# EAGLE design canSlaveV02_8s (EAGLE 6.3)

## Sheet 1 of 6
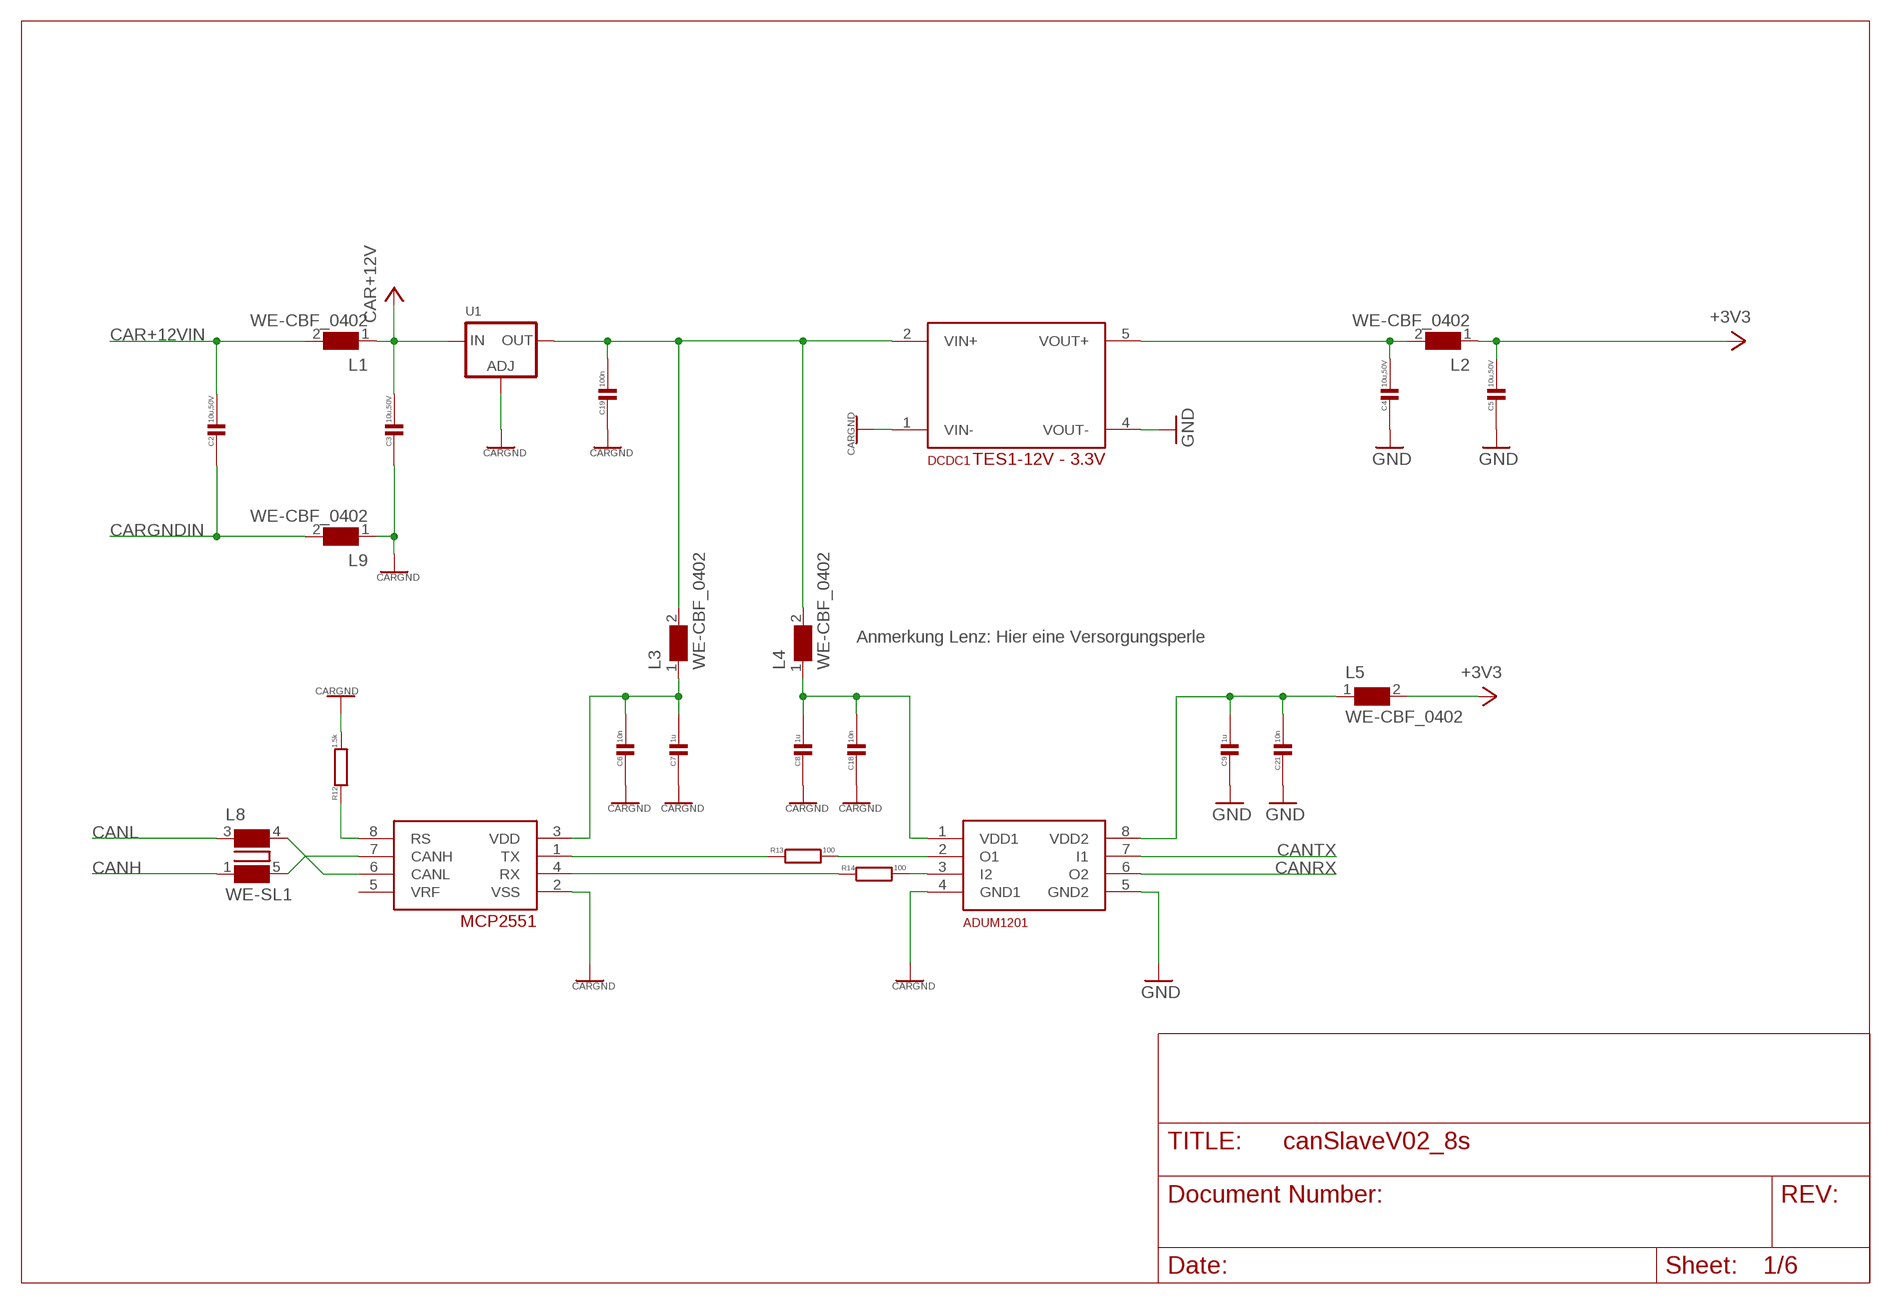
[diagram p0: schematic, sheet 1]

### Parts
C2  10u,50V  C0603  [C0603]
C3  10u,50V  C0603  [C0603]
C4  10u,50V  C0603  [C0603]
C5  10u,50V  C0603  [C0603]
C6  10n  C0402  [C0402]
C7  1u  C0402  [C0402]
C8  1u  C0402  [C0402]
C9  1u  C0402  [C0402]
C18  10n  C0402  [C0402]
C19  100n  C0402  [C0402]
C21  10n  C0402  [C0402]
DCDC1  TES1-12V - 3.3V  ISFXXXXA  [ISF]
IC3  ADUM1201  [SO-8]
IC4  MCP2551  [SO-8]
L1  WE-CBF_0402  [0402]
L2  WE-CBF_0402  [0402]
L3  WE-CBF_0402  [0402]
L4  WE-CBF_0402  [0402]
L5  WE-CBF_0402  [0402]
L8  WE-SL1  [WE-SL1]
L9  WE-CBF_0402  [0402]
R12  1.5k  R0402  [R0402]
R13  100  R0402  [R0402]
R14  100  R0402  [R0402]
U1  LM1117SOT223-REFLOW  [SOT223-R]

### Nets
+3V3: C5.1 L2.1 L5.2 ; also sheet 2,3
+3V3_AD: C9.1 C21.1 IC3.8(VDD2) L5.1
+3V3DCOUT: C4.1 DCDC1.5(VOUT+) L2.2
CANH: L8.1 ; also sheet 6
CANHL: IC4.7(CANH) L8.5
CANL: L8.3 ; also sheet 6
CANLL: IC4.6(CANL) L8.4
CANRX: IC3.6(O2) ; also sheet 2
CANTX: IC3.7(I1) ; also sheet 2
CAR+5V: C19.1 DCDC1.2(VIN+) L3.2 L4.2 U1.2(OUT) U1.4(OUT)
CAR+5V_AD: C8.1 C18.1 IC3.1(VDD1) L4.1
CAR+5V_CT: C6.1 C7.1 IC4.3(VDD) L3.1
CAR+12V: C3.1 L1.1 U1.3(IN)
CAR+12VIN: C2.1 L1.2 ; also sheet 6
CAR_CANRX: IC3.3(I2) R14.2
CAR_CANRX_T: IC4.4(RX) R14.1
CAR_CANTX: IC3.2(O1) R13.2
CAR_CANTX_T: IC4.1(TX) R13.1
CARGND: C3.2 C6.2 C7.2 C8.2 C18.2 C19.2 DCDC1.1(VIN-) IC3.4(GND1) IC4.2(VSS) L9.1 R12.2 U1.1(ADJ) ; also sheet 6
CARGNDIN: C2.2 L9.2 ; also sheet 6
GND: C4.2 C5.2 C9.2 C21.2 DCDC1.4(VOUT-) IC3.5(GND2) ; also sheet 2,3,5,6
RS: IC4.8(RS) R12.1
Unconnected: IC4.5(VRF)

### Notes on the sheet
- Anmerkung Lenz: Hier eine Versorgungsperle

## Sheet 2 of 6
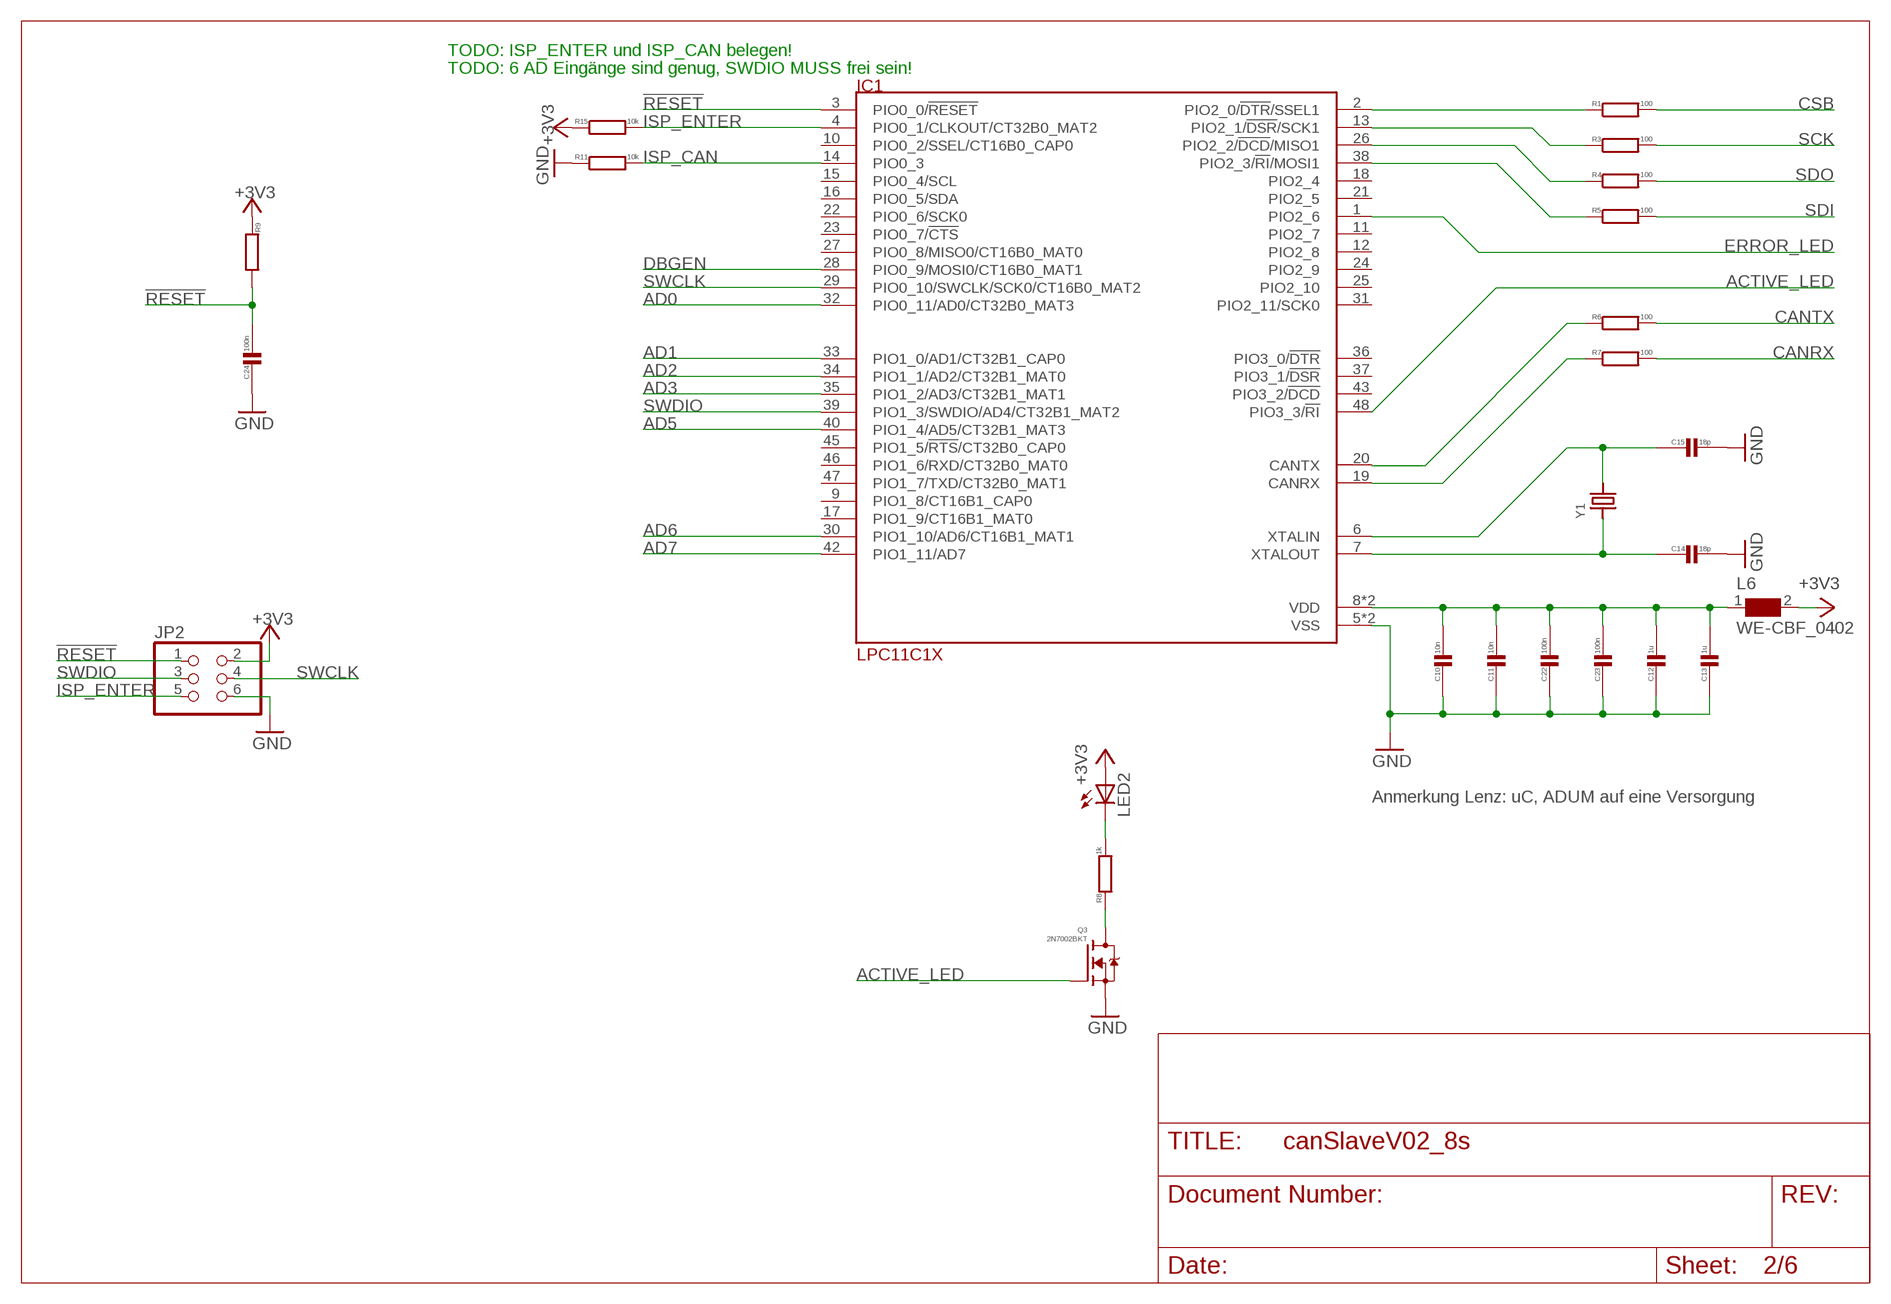
[diagram p1: schematic, sheet 2]

### Parts
C10  10n  C0402  [C0402]
C11  10n  C0402  [C0402]
C12  1u  C0402  [C0402]
C13  1u  C0402  [C0402]
C14  18p  C0402  [C0402]
C15  18p  C0402  [C0402]
C22  100n  C0402  [C0402]
C23  100n  C0402  [C0402]
C24  100n  C0402  [C0402]
IC1  LPC11C1X  [LQFP48]
JP2  HEADER-2X31.27  [2X03_1.27MM_SMT]
L6  WE-CBF_0402  [0402]
LED2  LEDCHIP-LED0603  [CHIP-LED0603]
Q3  2N7002BKT  [SOT416]
R1  100  R0402  [R0402]
R3  100  R0402  [R0402]
R4  100  R0402  [R0402]
R5  100  R0402  [R0402]
R6  100  R0402  [R0402]
R7  100  R0402  [R0402]
R8  1k  R0402  [R0402]
R9  R0402  [R0402]
R11  10k  R0402  [R0402]
R15  10k  R0402  [R0402]
Y1  CRYSTALTHIN  [CRYSTAL_3.2X2.5]

### Nets
!RESET: C24.1 IC1.3(PIO0_0/!RESET) JP2.1 R9.2
+3V3: JP2.2 L6.2 LED2.A R9.1 R15.1 ; also sheet 1,3
+3V3_UC: C10.1 C11.1 C12.1 C13.1 C22.1 C23.1 IC1.8(VDD) IC1.44(VDD) L6.1 ; also sheet 5
ACTIVE_LED: IC1.48(PIO3_3/!RI) Q3.1(G)
AD0: IC1.32(PIO0_11/AD0/CT32B0_MAT3)
AD1: IC1.33(PIO1_0/AD1/CT32B1_CAP0) ; also sheet 5,6
AD2: IC1.34(PIO1_1/AD2/CT32B1_MAT0) ; also sheet 5,6
AD3: IC1.35(PIO1_2/AD3/CT32B1_MAT1)
AD5: IC1.40(PIO1_4/AD5/CT32B1_MAT3)
AD6: IC1.30(PIO1_10/AD6/CT16B1_MAT1)
AD7: IC1.42(PIO1_11/AD7)
CANRX: R7.2 ; also sheet 1
CANRX_U: IC1.19(CANRX) R7.1
CANTX: R6.2 ; also sheet 1
CANTX_U: IC1.20(CANTX) R6.1
CSB: R1.2 ; also sheet 3
DBGEN: IC1.28(PIO0_9/MOSI0/CT16B0_MAT1)
ERROR_LED: IC1.1(PIO2_6)
GND: C10.2 C11.2 C12.2 C13.2 C14.1 C15.1 C22.2 C23.2 C24.2 IC1.5(VSS) IC1.41(VSS) JP2.6 Q3.2(S) R11.1 ; also sheet 1,3,5,6
ISP_CAN: IC1.14(PIO0_3) R11.2
ISP_ENTER: IC1.4(PIO0_1/CLKOUT/CT32B0_MAT2) JP2.5 R15.2
LED1C1: LED2.C R8.2
MISO1: IC1.26(PIO2_2/!DCD!/MISO1) R4.1
MOSI1: IC1.38(PIO2_3/!RI!/MOSI1) R5.1
Q3_COL: Q3.3(D) R8.1
SCK: R3.2 ; also sheet 3
SCK1: IC1.13(PIO2_1/!DSR!/SCK1) R3.1
SDI: R5.2 ; also sheet 3
SDO: R4.2 ; also sheet 3
SSEL: IC1.2(PIO2_0/!DTR!/SSEL1) R1.1
SWCLK: IC1.29(PIO0_10/SWCLK/SCK0/CT16B0_MAT2) JP2.4
SWDIO: IC1.39(PIO1_3/SWDIO/AD4/CT32B1_MAT2) JP2.3
XTALIN: C15.2 IC1.6(XTALIN) Y1.2
XTALOUT: C14.2 IC1.7(XTALOUT) Y1.1
Unconnected: IC1.9(PIO1_8/CT16B1_CAP0) IC1.10(PIO0_2/SSEL/CT16B0_CAP0) IC1.11(PIO2_7) IC1.12(PIO2_8) IC1.15(PIO0_4/SCL) IC1.16(PIO0_5/SDA) IC1.17(PIO1_9/CT16B1_MAT0) IC1.18(PIO2_4) IC1.21(PIO2_5) IC1.22(PIO0_6/SCK0) IC1.23(PIO0_7/!CTS) IC1.24(PIO2_9) IC1.25(PIO2_10) IC1.27(PIO0_8/MISO0/CT16B0_MAT0) IC1.31(PIO2_11/SCK0) IC1.36(PIO3_0/!DTR) IC1.37(PIO3_1/!DSR) IC1.43(PIO3_2/!DCD) IC1.45(PIO1_5/!RTS!/CT32B0_CAP0) IC1.46(PIO1_6/RXD/CT32B0_MAT0) IC1.47(PIO1_7/TXD/CT32B0_MAT1)

### Notes on the sheet
- TODO: ISP_ENTER und ISP_CAN belegen!
- TODO: 6 AD Eingänge sind genug, SWDIO MUSS frei sein!
- Anmerkung Lenz: uC, ADUM auf eine Versorgung

## Sheet 3 of 6
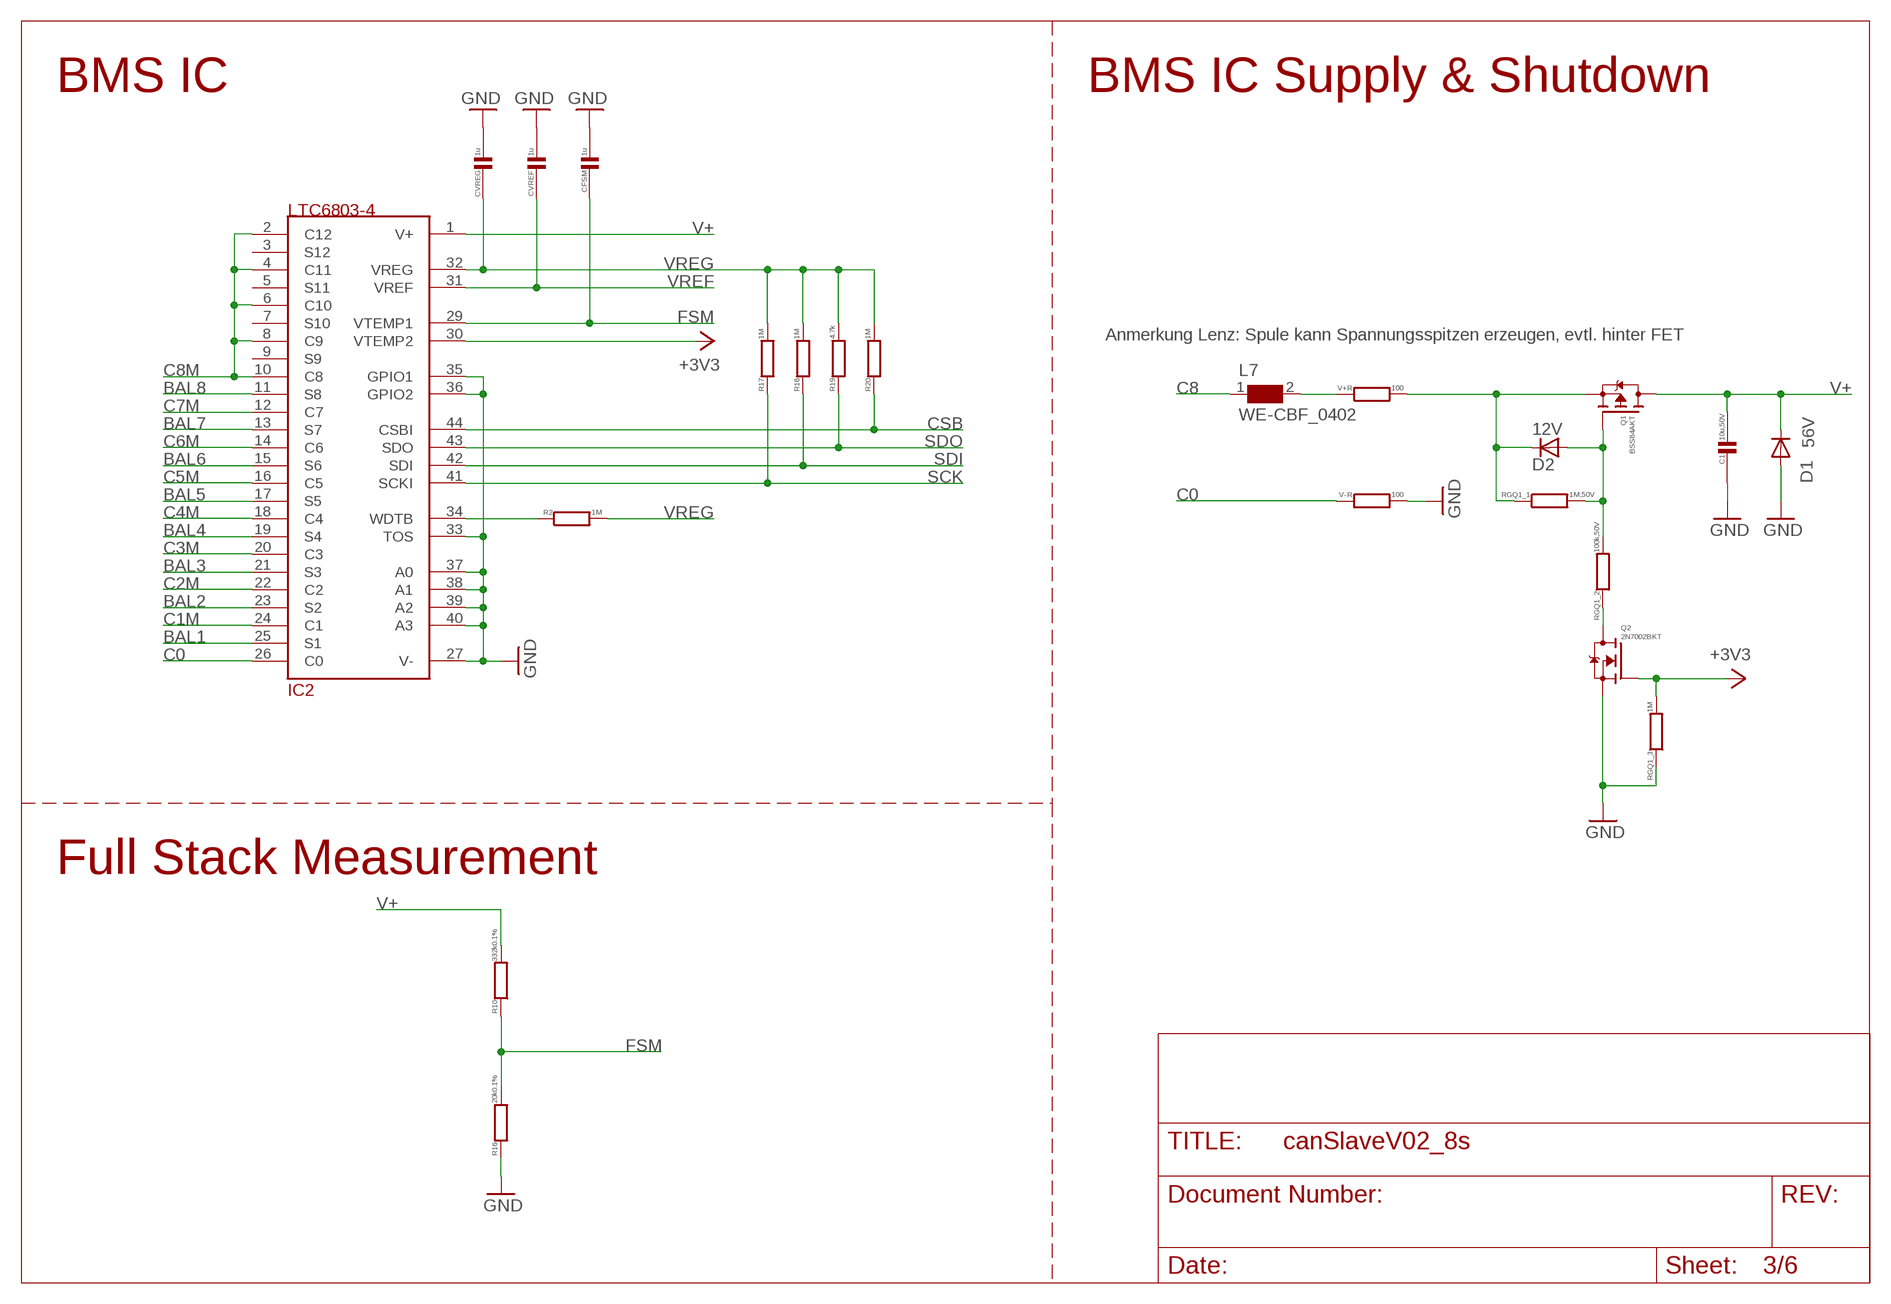
[diagram p2: schematic, sheet 3]

### Parts
C1  10u,50V  C1206  [C1206]
CFSM  1u  C0402  [C0402]
CVREF  1u  C0402  [C0402]
CVREG  1u  C0402  [C0402]
D1  56V  DIODE-SOD323-R  [SOD323-R]
D2  12V  DIODE-SOD323-R  [SOD323-R]
IC2  LTC6803-4  [44SSOP]
L7  WE-CBF_0402  [0402]
Q1  BSS84AKT  [SOT416]
Q2  2N7002BKT  [SOT416]
R2  1M  R0402  [R0402]
R10  332k0.1%  R0603  [R0603]
R16  20k0.1%  R0603  [R0603]
R17  1M  R0402  [R0402]
R18  1M  R0402  [R0402]
R19  4.7k  R0402  [R0402]
R20  1M  R0402  [R0402]
RGQ1_1  1M,50V  R0603  [R0603]
RGQ1_2  100k,50V  R0603  [R0603]
RGQ1_3  1M  R0402  [R0402]
V+R  100  R0402  [R0402]
V-R  100  R0402  [R0402]

### Nets
+3V3: IC2.30(VTEMP2) Q2.1(G) RGQ1_3.2 ; also sheet 1,2
BAL1: IC2.25(S1) ; also sheet 4
BAL2: IC2.23(S2) ; also sheet 4
BAL3: IC2.21(S3) ; also sheet 4
BAL4: IC2.19(S4) ; also sheet 4
BAL5: IC2.17(S5) ; also sheet 4
BAL6: IC2.15(S6) ; also sheet 4
BAL7: IC2.13(S7) ; also sheet 4
BAL8: IC2.11(S8) ; also sheet 4
C0: IC2.26(C0) V-R.1 ; also sheet 4,6
C1M: IC2.24(C1) ; also sheet 4
C2M: IC2.22(C2) ; also sheet 4
C3M: IC2.20(C3) ; also sheet 4
C4M: IC2.18(C4) ; also sheet 4
C5M: IC2.16(C5) ; also sheet 4
C6M: IC2.14(C6) ; also sheet 4
C7M: IC2.12(C7) ; also sheet 4
C8: L7.1 ; also sheet 4,6
C8F: L7.2 V+R.1
C8M: IC2.2(C12) IC2.4(C11) IC2.6(C10) IC2.8(C9) IC2.10(C8) ; also sheet 4
CSB: IC2.44(CSBI) R20.1 ; also sheet 2
FSM: CFSM.2 IC2.29(VTEMP1) R10.1 R16.2
GND: C1.2 CFSM.1 CVREF.1 CVREG.1 D1.A IC2.27(V-) IC2.33(TOS) IC2.35(GPIO1) IC2.36(GPIO2) IC2.37(A0) IC2.38(A1) IC2.39(A2) IC2.40(A3) Q2.2(S) R16.1 RGQ1_3.1 V-R.2 ; also sheet 1,2,5,6
Q1G: D2.A Q1.1(G) RGQ1_1.2 RGQ1_2.2
Q2D: Q2.3(D) RGQ1_2.1
SCK: IC2.41(SCKI) R17.1 ; also sheet 2
SDI: IC2.42(SDI) R18.1 ; also sheet 2
SDO: IC2.43(SDO) R19.1 ; also sheet 2
V+: C1.1 D1.C IC2.1(V+) Q1.3(D) R10.2
V+S: D2.C Q1.2(S) RGQ1_1.1 V+R.2
VREF: CVREF.2 IC2.31(VREF)
VREG: CVREG.2 IC2.32(VREG) R2.2 R17.2 R18.2 R19.2 R20.2
WDTB: IC2.34(WDTB) R2.1
Unconnected: IC2.3(S12) IC2.5(S11) IC2.7(S10) IC2.9(S9)

### Notes on the sheet
- BMS IC | BMS IC Supply & Shutdown
- Anmerkung Lenz: Spule kann Spannungsspitzen erzeugen, evtl. hinter FET
- Full Stack Measurement

## Sheet 4 of 6
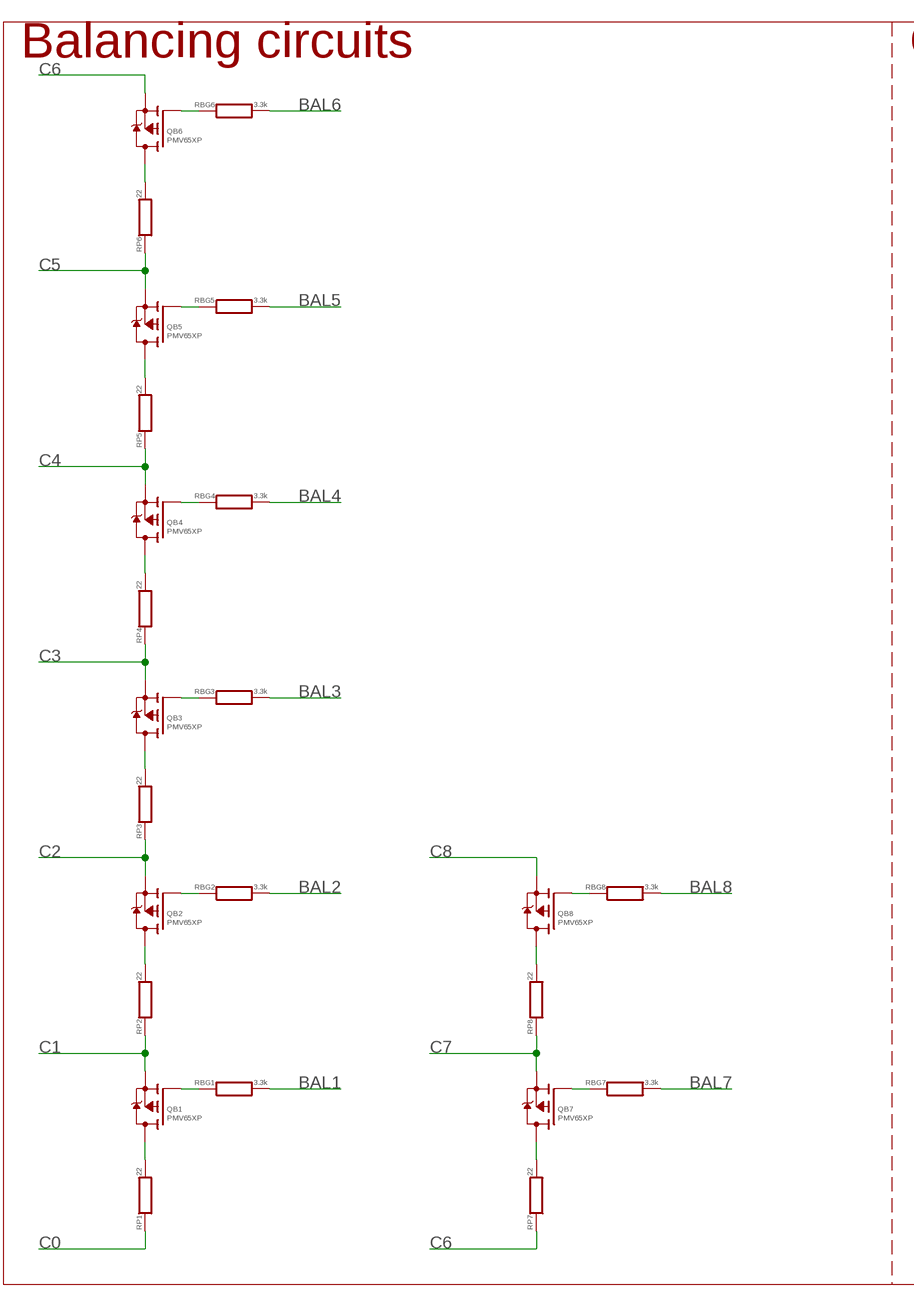
[diagram p3: schematic, sheet 4, part 1 of 2]
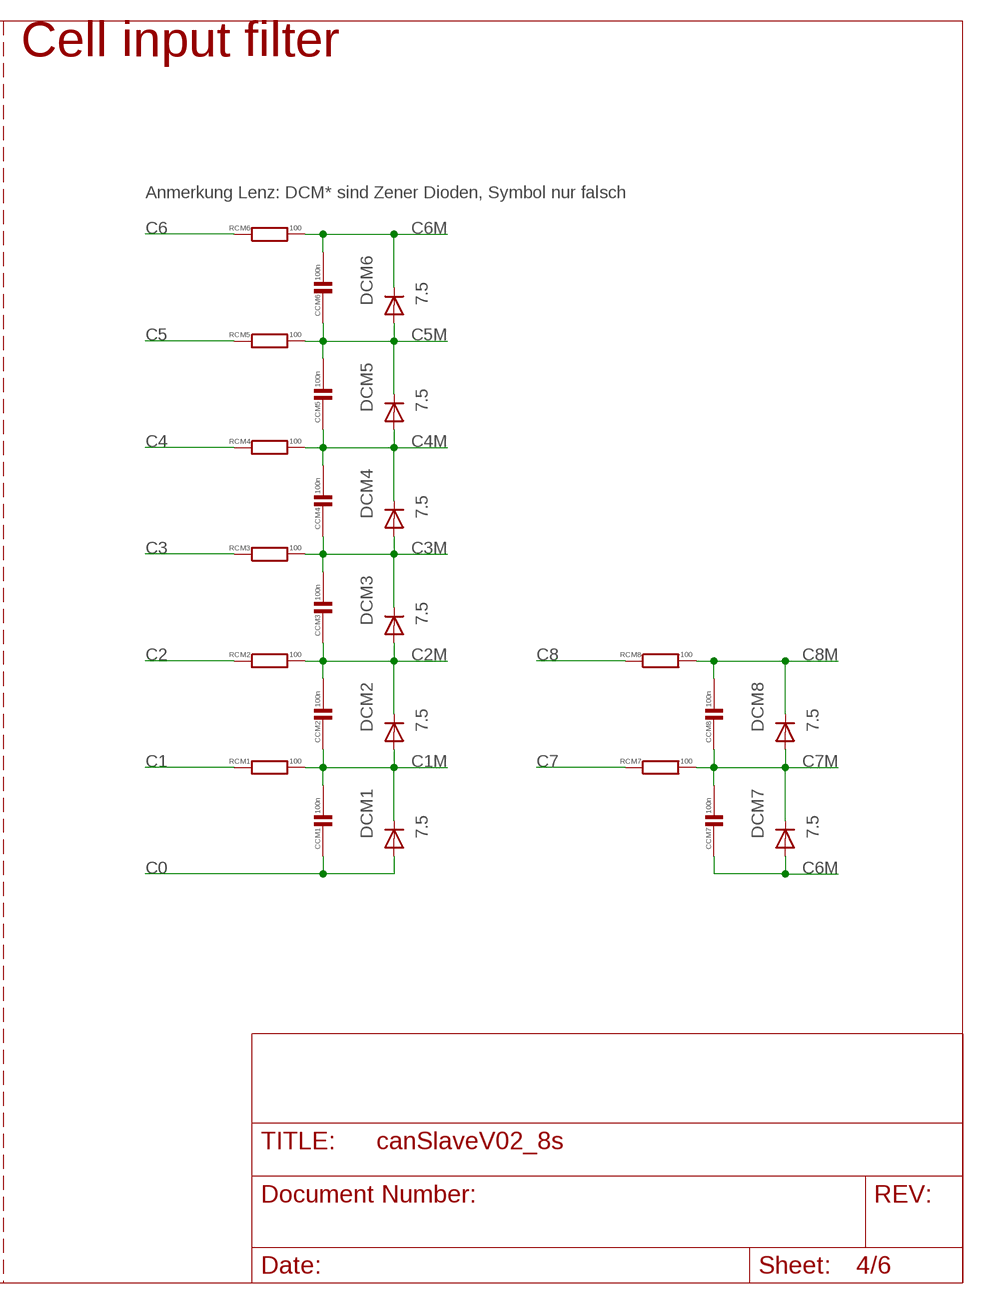
[diagram p4: schematic, sheet 4, part 2 of 2]

### Parts
CCM1  100n  C0402  [C0402]
CCM2  100n  C0402  [C0402]
CCM3  100n  C0402  [C0402]
CCM4  100n  C0402  [C0402]
CCM5  100n  C0402  [C0402]
CCM6  100n  C0402  [C0402]
CCM7  100n  C0402  [C0402]
CCM8  100n  C0402  [C0402]
DCM1  7.5  DIODE-SOD323-R  [SOD323-R]
DCM2  7.5  DIODE-SOD323-R  [SOD323-R]
DCM3  7.5  DIODE-SOD323-R  [SOD323-R]
DCM4  7.5  DIODE-SOD323-R  [SOD323-R]
DCM5  7.5  DIODE-SOD323-R  [SOD323-R]
DCM6  7.5  DIODE-SOD323-R  [SOD323-R]
DCM7  7.5  DIODE-SOD323-R  [SOD323-R]
DCM8  7.5  DIODE-SOD323-R  [SOD323-R]
QB1  PMV65XP  BSS84AKT  [SOT416]
QB2  PMV65XP  BSS84AKT  [SOT416]
QB3  PMV65XP  BSS84AKT  [SOT416]
QB4  PMV65XP  BSS84AKT  [SOT416]
QB5  PMV65XP  BSS84AKT  [SOT416]
QB6  PMV65XP  BSS84AKT  [SOT416]
QB7  PMV65XP  BSS84AKT  [SOT416]
QB8  PMV65XP  BSS84AKT  [SOT416]
RBG1  3.3k  R0402  [R0402]
RBG2  3.3k  R0402  [R0402]
RBG3  3.3k  R0402  [R0402]
RBG4  3.3k  R0402  [R0402]
RBG5  3.3k  R0402  [R0402]
RBG6  3.3k  R0402  [R0402]
RBG7  3.3k  R0402  [R0402]
RBG8  3.3k  R0402  [R0402]
RCM1  100  R0402  [R0402]
RCM2  100  R0402  [R0402]
RCM3  100  R0402  [R0402]
RCM4  100  R0402  [R0402]
RCM5  100  R0402  [R0402]
RCM6  100  R0402  [R0402]
RCM7  100  R0402  [R0402]
RCM8  100  R0402  [R0402]
RP1  22  R2512  [R2512]
RP2  22  R2512  [R2512]
RP3  22  R2512  [R2512]
RP4  22  R2512  [R2512]
RP5  22  R2512  [R2512]
RP6  22  R2512  [R2512]
RP7  22  R2512  [R2512]
RP8  22  R2512  [R2512]

### Nets
BAL1: RBG1.2 ; also sheet 3
BAL2: RBG2.2 ; also sheet 3
BAL3: RBG3.2 ; also sheet 3
BAL4: RBG4.2 ; also sheet 3
BAL5: RBG5.2 ; also sheet 3
BAL6: RBG6.2 ; also sheet 3
BAL7: RBG7.2 ; also sheet 3
BAL8: RBG8.2 ; also sheet 3
C0: CCM1.2 DCM1.A RP1.1 ; also sheet 3,6
C1: QB1.2(S) RCM1.1 RP2.1 ; also sheet 6
C1M: CCM1.1 CCM2.2 DCM1.C DCM2.A RCM1.2 ; also sheet 3
C2: QB2.2(S) RCM2.1 RP3.1 ; also sheet 6
C2M: CCM2.1 CCM3.2 DCM2.C DCM3.A RCM2.2 ; also sheet 3
C3: QB3.2(S) RCM3.1 RP4.1 ; also sheet 6
C3M: CCM3.1 CCM4.2 DCM3.C DCM4.A RCM3.2 ; also sheet 3
C4: QB4.2(S) RCM4.1 RP5.1 ; also sheet 6
C4M: CCM4.1 CCM5.2 DCM4.C DCM5.A RCM4.2 ; also sheet 3
C5: QB5.2(S) RCM5.1 RP6.1 ; also sheet 6
C5M: CCM5.1 CCM6.2 DCM5.C DCM6.A RCM5.2 ; also sheet 3
C6: QB6.2(S) RCM6.1 RP7.1 ; also sheet 6
C6M: CCM6.1 CCM7.2 DCM6.C DCM7.A RCM6.2 ; also sheet 3
C7: QB7.2(S) RCM7.1 RP8.1 ; also sheet 6
C7M: CCM7.1 CCM8.2 DCM7.C DCM8.A RCM7.2 ; also sheet 3
C8: QB8.2(S) RCM8.1 ; also sheet 3,6
C8M: CCM8.1 DCM8.C RCM8.2 ; also sheet 3
CR1: QB1.3(D) RP1.2
CR2: QB2.3(D) RP2.2
CR3: QB3.3(D) RP3.2
CR4: QB4.3(D) RP4.2
CR5: QB5.3(D) RP5.2
CR6: QB6.3(D) RP6.2
CR7: QB7.3(D) RP7.2
CR8: QB8.3(D) RP8.2
QBG1: QB1.1(G) RBG1.1
QBG2: QB2.1(G) RBG2.1
QBG3: QB3.1(G) RBG3.1
QBG4: QB4.1(G) RBG4.1
QBG5: QB5.1(G) RBG5.1
QBG6: QB6.1(G) RBG6.1
QBG7: QB7.1(G) RBG7.1
QBG8: QB8.1(G) RBG8.1

### Notes on the sheet
- Balancing circuits | Cell input filter
- Anmerkung Lenz: DCM* sind Zener Dioden, Symbol nur falsch

## Sheet 5 of 6
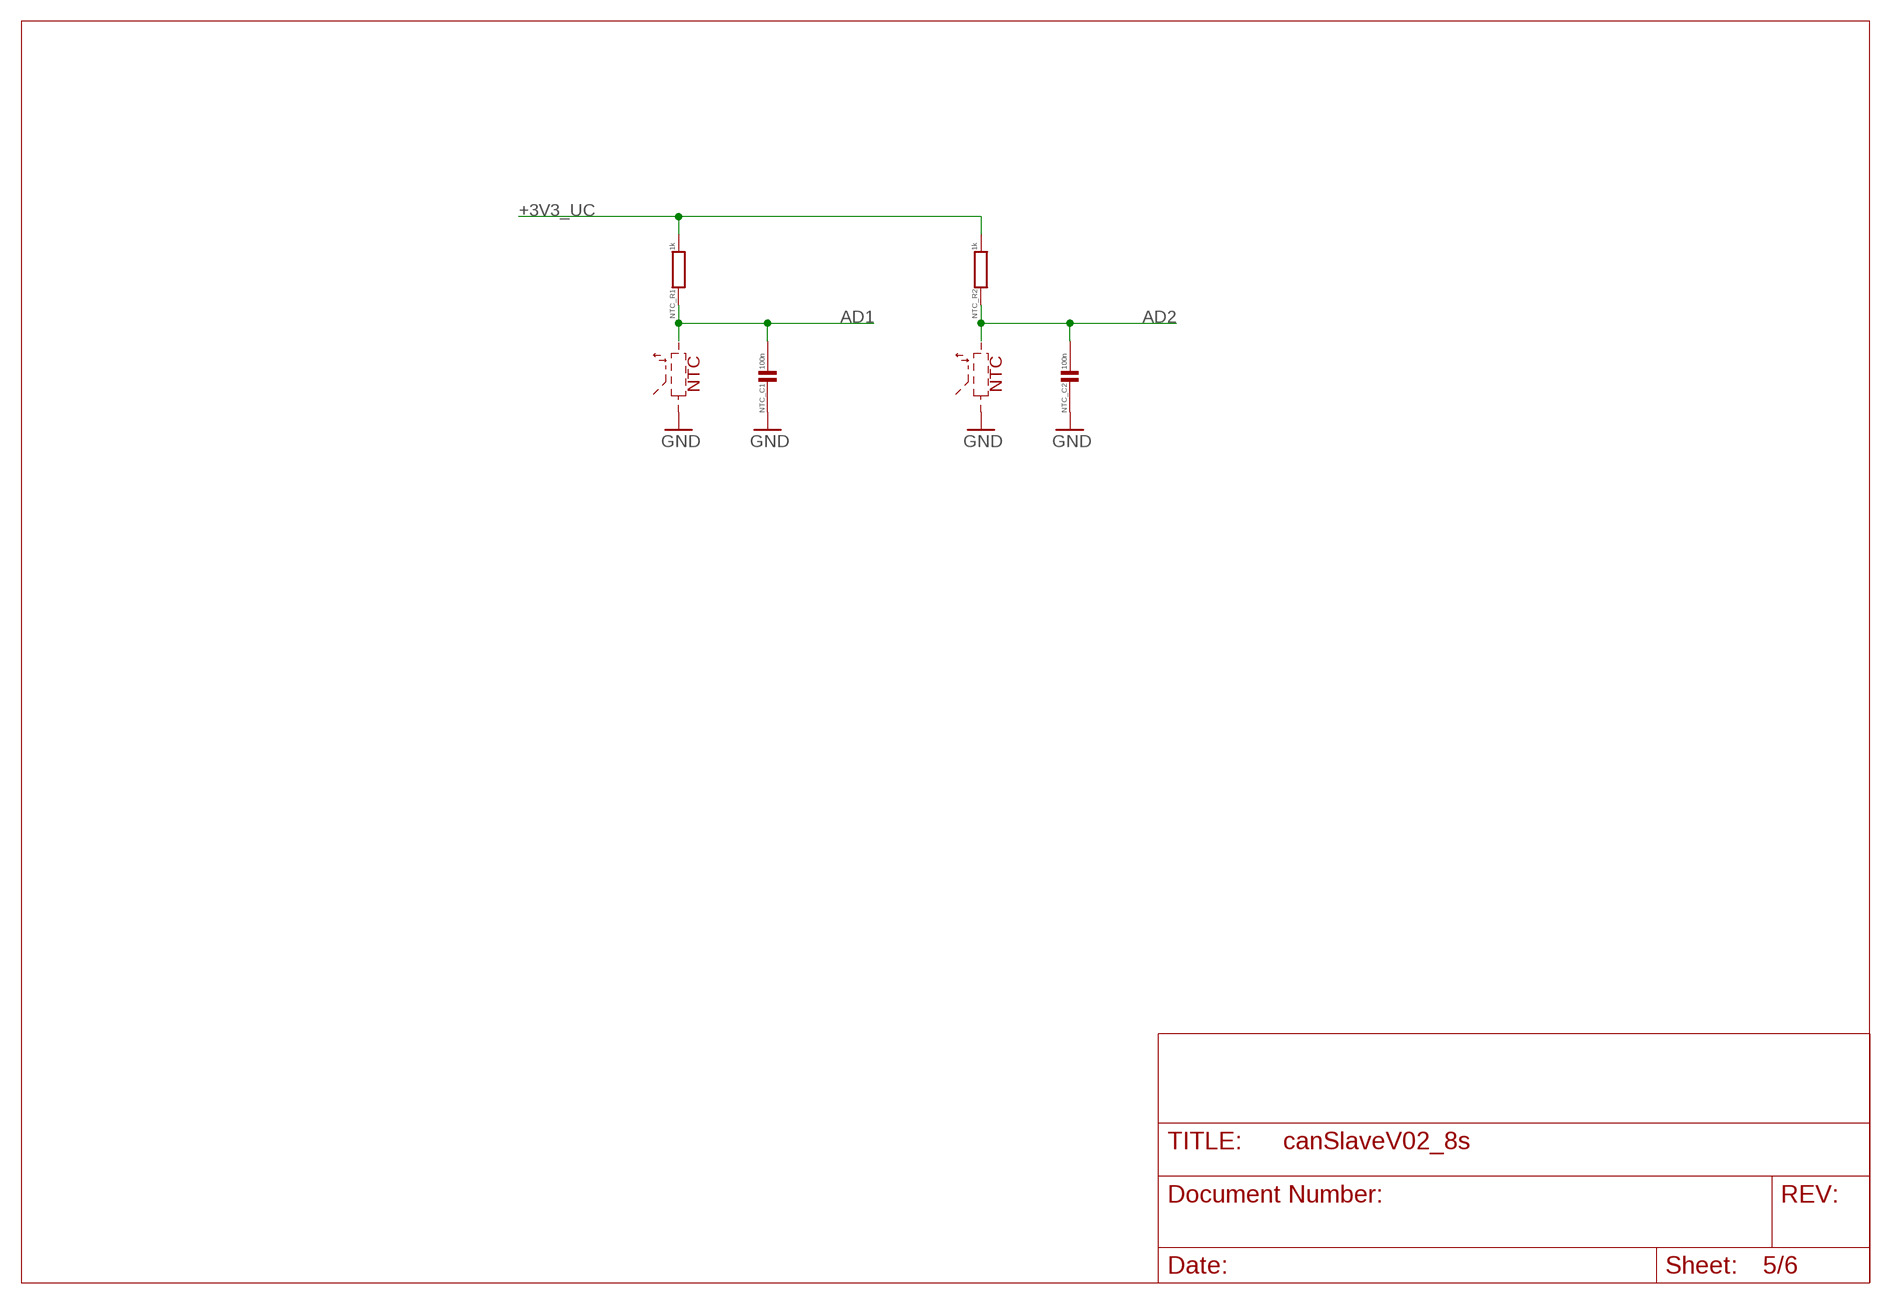
[diagram p5: schematic, sheet 5]

### Parts
NTC_C1  100n  C0402  [C0402]
NTC_C2  100n  C0402  [C0402]
NTC_R1  1k  R0402  [R0402]
NTC_R2  1k  R0402  [R0402]

### Nets
+3V3_UC: NTC_R1.2 NTC_R2.2 ; also sheet 2
AD1: NTC_C1.1 NTC_R1.1 ; also sheet 2,6
AD2: NTC_C2.1 NTC_R2.1 ; also sheet 2,6
GND: NTC_C1.2 NTC_C2.2 ; also sheet 1,2,3,6

### Notes on the sheet
- NTC | NTC

## Sheet 6 of 6
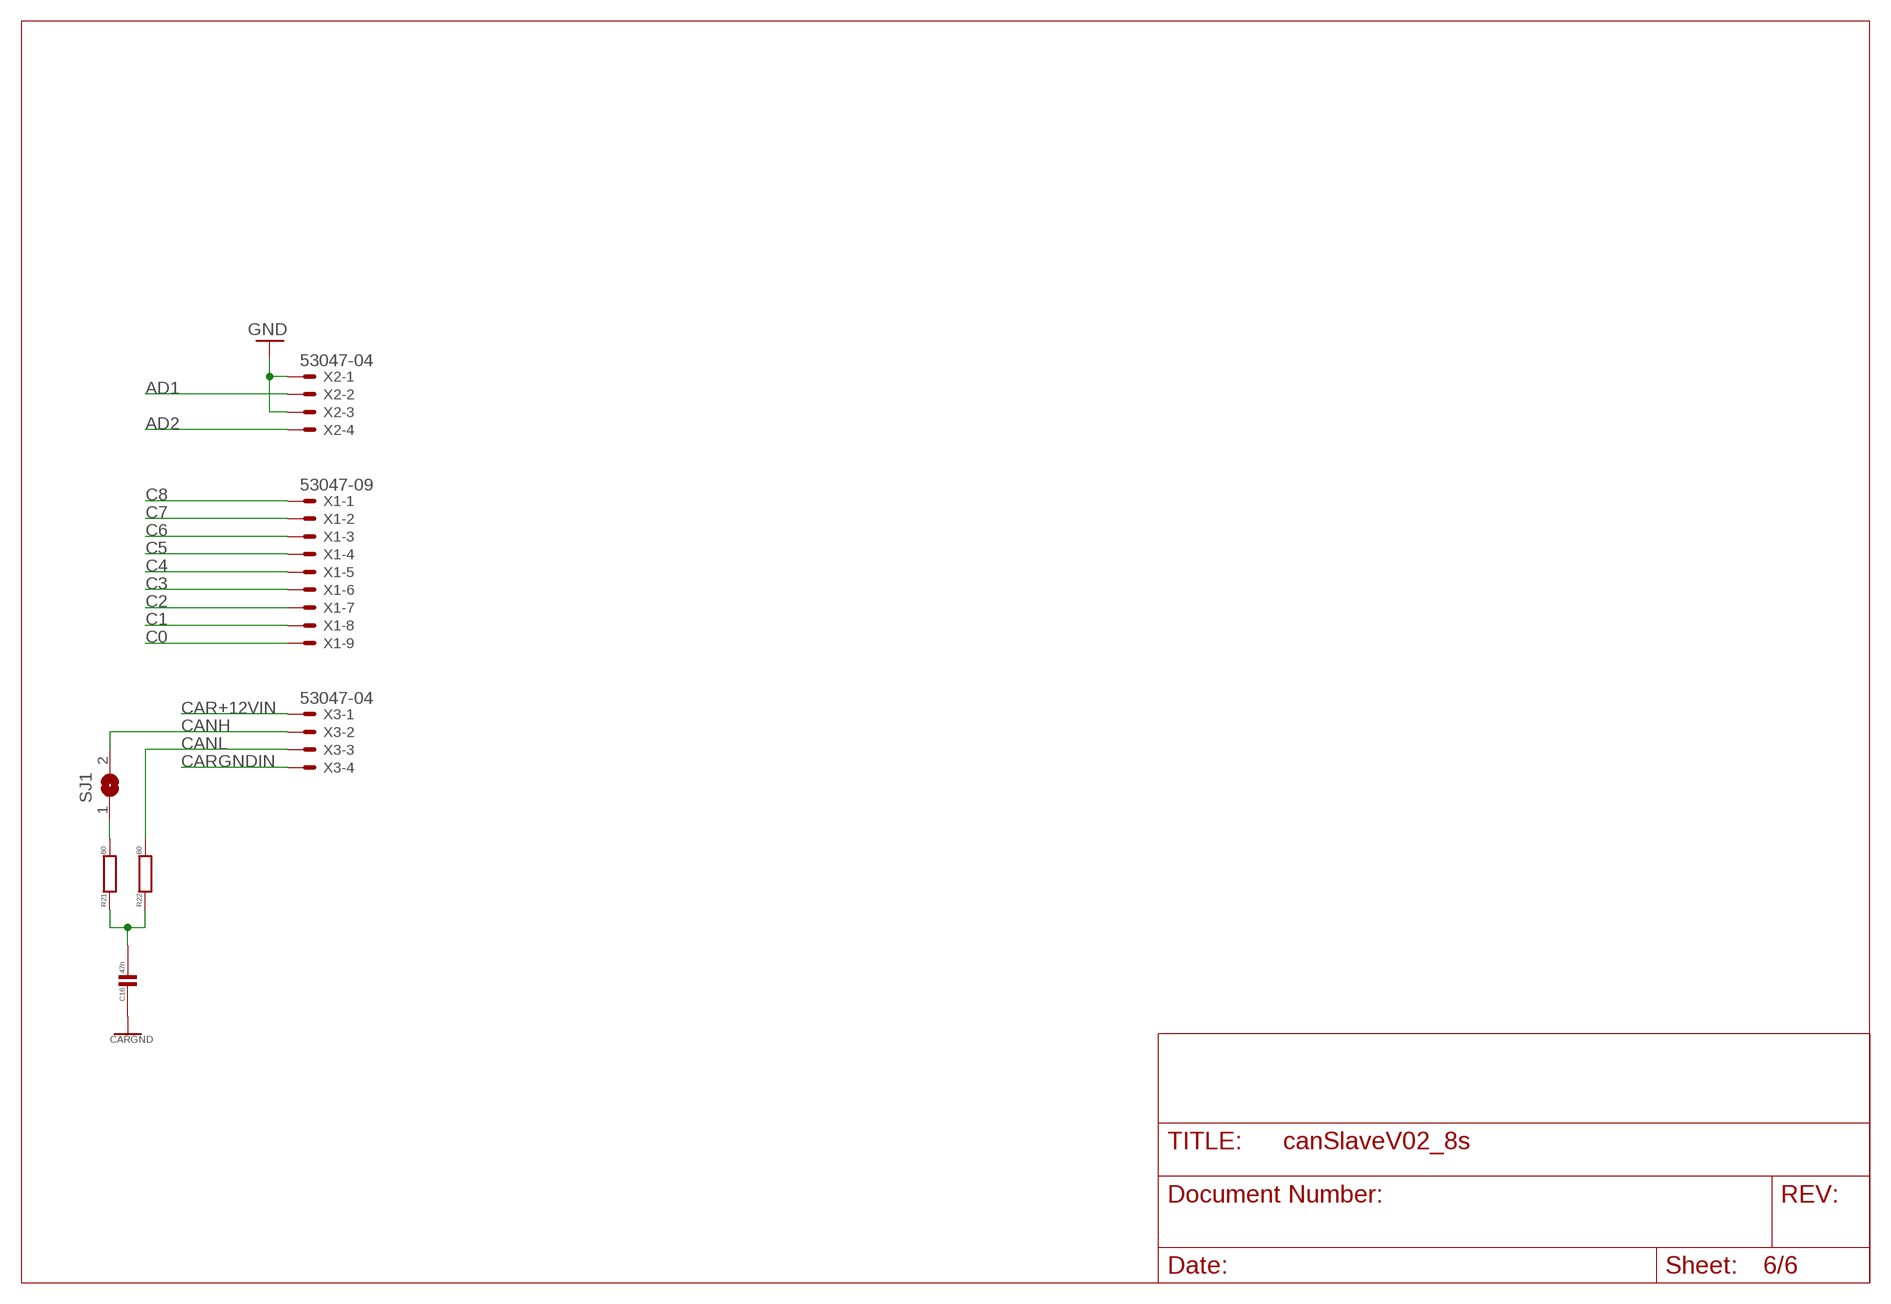
[diagram p6: schematic, sheet 6]

### Parts
C16  47n  C0402  [C0402]
R21  60  R0402  [R0402]
R22  60  R0402  [R0402]
SJ1  SOLDERJUMPERSMALL  [SOLDERJUMPER_REFLOW_NOPASTE_SMALL]
X1  53047-09  [53047-09]
X2  53047-04  [53047-04]
X3  53047-04  [53047-04]

### Nets
AD1: X2.2 ; also sheet 2,5
AD2: X2.4 ; also sheet 2,5
C0: X1.9 ; also sheet 3,4
C1: X1.8 ; also sheet 4
C2: X1.7 ; also sheet 4
C3: X1.6 ; also sheet 4
C4: X1.5 ; also sheet 4
C5: X1.4 ; also sheet 4
C6: X1.3 ; also sheet 4
C7: X1.2 ; also sheet 4
C8: X1.1 ; also sheet 3,4
CANH: SJ1.2 X3.2 ; also sheet 1
CANJ: R21.2 SJ1.1
CANL: R22.2 X3.3 ; also sheet 1
CANT: C16.1 R21.1 R22.1
CAR+12VIN: X3.1 ; also sheet 1
CARGND: C16.2 ; also sheet 1
CARGNDIN: X3.4 ; also sheet 1
GND: X2.1 X2.3 ; also sheet 1,2,3,5

## Library data of the parts
C1-C16 C18 C19 C21-C24 CCM1-CCM8 CFSM CVREF CVREG NTC_C1 NTC_C2 = phrenetic:C
D1 D2 DCM1-DCM8 = diode:DIODE-: DIODE
DCDC1 = bms-hsrm:ISFXXXXA
IC1 = phrenetic:LPC11C1X
IC2 = bms-hsrm:LTC6803-4
IC3 = bms-hsrm:ADUM1201
IC4 = bms-hsrm:MCP2551
JP2 = microbuilder:HEADER-2X3: PIN HEADER
L1-L7 L9 = EagleLibrary_Wuerth_Elektronik_eiSos_Version_6:WE-CBF: SMD EMI Suppression Ferrite Beads WE-CBF - Excellent anti-EMI properties - Low DC-restistance - Impedances till 3000 ohms - Rated current up to 6 A -- Reliable Ni-Sn electrodes -- Perfect as data lined filter and for uncoupling of distribution voltage
L8 = EagleLibrary_Wuerth_Elektronik_eiSos_Version_6:WE-SL1: SMD Common Mode Line Filter WE-SL1 - Small size - Low Profile, only 1,65 mm - High Impedance up to 2000 ohm - High Current up to 300mA - Low leakage inductance -- USB -- CAN -- Firewire -- Data Lines -- Power Lines
LED2 = led:LED: LED OSRAM: - CHIPLED LG R971, LG N971, LY N971, LG Q971, LY Q971, LO R971, LY R971 LH N974, LH R974 LS Q976, LO Q976, LY Q976 LO Q996 - Hyper CHIPLED LW Q18S LB Q993, LB Q99A, LB R99A - SideLED LS A670, LO A670, LY A670, LG A670, LP A670 LB A673, LV A673, LT A673, LW A673 LH A674 LY A675 LS A676, LA A676, LO A676, LY A676, LW A676 LS A679, LY A679, LG A679 - Hyper Micro SIDELED® LS Y876, LA Y876, LO Y876, LY Y876 LT Y87S - SmartLED LW L88C, LW L88S LB L89C, LB L89S, LG L890 LS L89K, LO L89K, LY L89K LS L896, LA L896, LO L896, LY L896 - TOPLED LS T670, LO T670, LY T670, LG T670, LP T670 LSG T670, LSP T670, LSY T670, LOP T670, LYG T670 LG T671, LOG T671, LSG T671 LB T673, LV T673, LT T673, LW T673 LH T674 LS T676, LA T676, LO T676, LY T676, LB T676, LH T676, LSB T676, LW T676 LB T67C, LV T67C, LT T67C, LS T67K, LO T67K, LY T67K, LW E67C LS E67B, LA E67B, LO E67B, LY E67B, LB E67C, LV E67C, LT E67C LW T67C LS T679, LY T679, LG T679 LS T770, LO T770, LY T770, LG T770, LP T770 LB T773, LV T773, LT T773, LW T773 LH T774 LS E675, LA E675, LY E675, LS T675 LS T776, LA T776, LO T776, LY T776, LB T776 LHGB T686 LT T68C, LB T68C - Hyper Mini TOPLED® LB M676 - Mini TOPLED Santana® LG M470 LS M47K, LO M47K, LY M47K Source: http://www.osram.convergy.de LUXEON: - LUMILED® LXK2-PW12-R00, LXK2-PW12-S00, LXK2-PW14-U00, LXK2-PW14-V00 LXK2-PM12-R00, LXK2-PM12-S00, LXK2-PM14-U00 LXK2-PE12-Q00, LXK2-PE12-R00, LXK2-PE12-S00, LXK2-PE14-T00, LXK2-PE14-U00 LXK2-PB12-K00, LXK2-PB12-L00, LXK2-PB12-M00, LXK2-PB14-N00, LXK2-PB14-P00, LXK2-PB14-Q00 LXK2-PR12-L00, LXK2-PR12-M00, LXK2-PR14-Q00, LXK2-PR14-R00 LXK2-PD12-Q00, LXK2-PD12-R00, LXK2-PD12-S00 LXK2-PH12-R00, LXK2-PH12-S00 LXK2-PL12-P00, LXK2-PL12-Q00, LXK2-PL12-R00 Source: www.luxeon.com KINGBRIGHT: KA-3528ASYC Source: www.kingbright.com
NTC_R1 NTC_R2 R1-R22 RBG1-RBG8 RCM1-RCM8 RGQ1_1-RGQ1_3 RP1-RP8 V+R V-R = phrenetic:R: RESISTOR, Bla
Q1 QB1-QB8 = phrenetic:BSS84
Q2 Q3 = phrenetic:2N7002
SJ1 = microbuilder:SOLDERJUMPER: SMD Solder JUMPER Solder the two pads together to create a connection, or remove the solder to break it. REFLOW - Use this footprint for solder paste and reflow ovens. WAVE - Use this footprint for hand-soldering (larger pads). CLOSED - Has a trace between the two pads to ensure it is closed by default. The trace needs to be cut to disable the jumper, and can be closed again by creating a solder bridge between the two pads.
U1 = microbuilder:LM1117: LM1117 Voltage Regulator LM1117 Adjustable Voltage regulator [Digikey: LM1117IMP-ADJDKR-ND] LM1117 3.3V Voltage regulator [AP1117E33GDIDKR-ND] LM1117 5.0V Voltage regulator [AP1117E50GDIDKR-ND] SOT223-REFLOW - SOT223 package for solder paste/reflow ovens SOT223-WAVE - SOT223 package for hand-soldering (larger pads) Note: For the fixed-voltage regulators, simply set the ADJ pin to GND.
X1 = con-molex:53?-09: CONNECTOR wire to board 1.25 mm (.049 inch) pitch header; MPN: 53047-0910; OC_FARNELL: 9732888; OC_NEWARK: 98K9827
X2 X3 = con-molex:53?-04: CONNECTOR wire to board 1.25 mm (.049 inch) pitch header; MF: WALDOM/MOLEX; MPN: 53047-0410; OC_FARNELL: 9733060; OC_NEWARK: 38C9900
Y1 = microbuilder:CRYSTAL: Crystals HC49UP - Surface Mount Crystal 4.0MHz 18pF +/-30ppm Surface Mount Crystal [Digikey: 535-9857-1-ND] 12.0 MHz Surface Mount Crystal [Digikey: 535-9869-6-ND] 25.0 MHz Surface Mount Crystal [Digikey: 535-9078-1-ND] 2.5 x 2.0mm - MEMs SMT Crystal 16.0 MHz 10pF 20ppm 2.5 x 2.0mm Crystal [Digikey -40-85°C: 535-10923-1-ND] 3.2 x 2.5mm - MEMs SMT Crystal 12.0 MHz 8pF 15ppm 3.2 x 2.5mm Crystal [Digikey: -10-70°C: 644-1047-1-ND -40-125°C: 644-1128-1-ND] 16.0 MHz 8pF 15ppm 3.2 x 2.5mm Crystal [Digikey: -10-70°C: 644-1049-1-ND -40-125°C: 644-1129-2-ND] 16.0 MHz 10pF 10ppm 3.2 x 2.5mm Crystal [Digikey: 644-1100-1-ND] 27.12 MHz 18pF 30ppm 3.2 x 2.5mm Crystal [Digikey: 887-1424-1-ND] 27.12MHz 10pF 10ppm 3.2 x 2.5mm Crystal [Digikey: 887-1329-1-ND] 4.9 x 1.8mm - MEMs SMT Crystal 32.768 KHz 12.5pF 20ppm 4.9 x 1.8mm Crystal [Digikey: SE2415CT-ND] 8.0 x 3.8mm - Surface Mount Crystal 32.768kHz 12.5pF 20ppm -40°C-85°C [Digikey: 535-9166-2-ND] Cylinder 32.768KHz Cylinder Crystal (2x6mm body) [Ex. Digikey: 300-8341-2-ND]

## Board
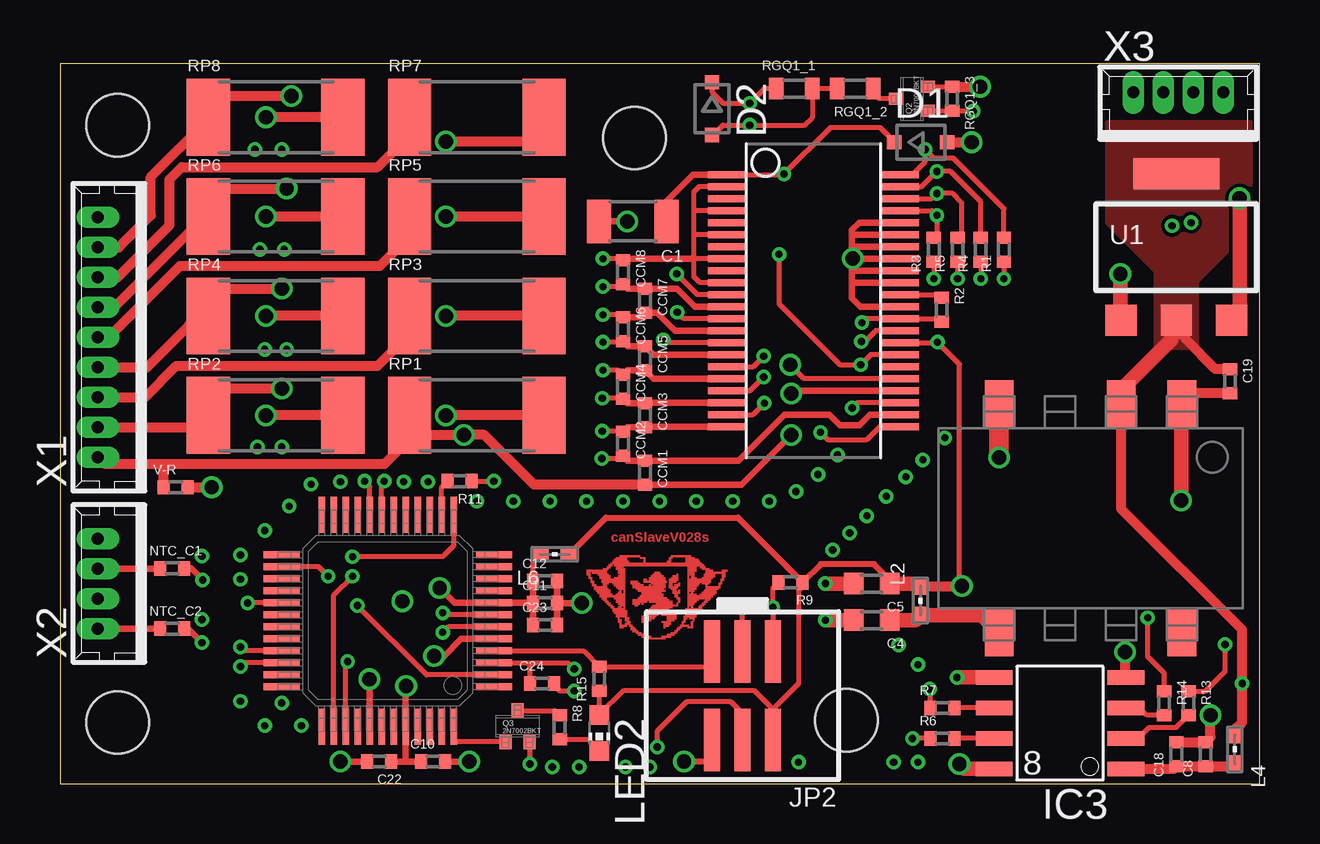
[diagram p7: board, top side]
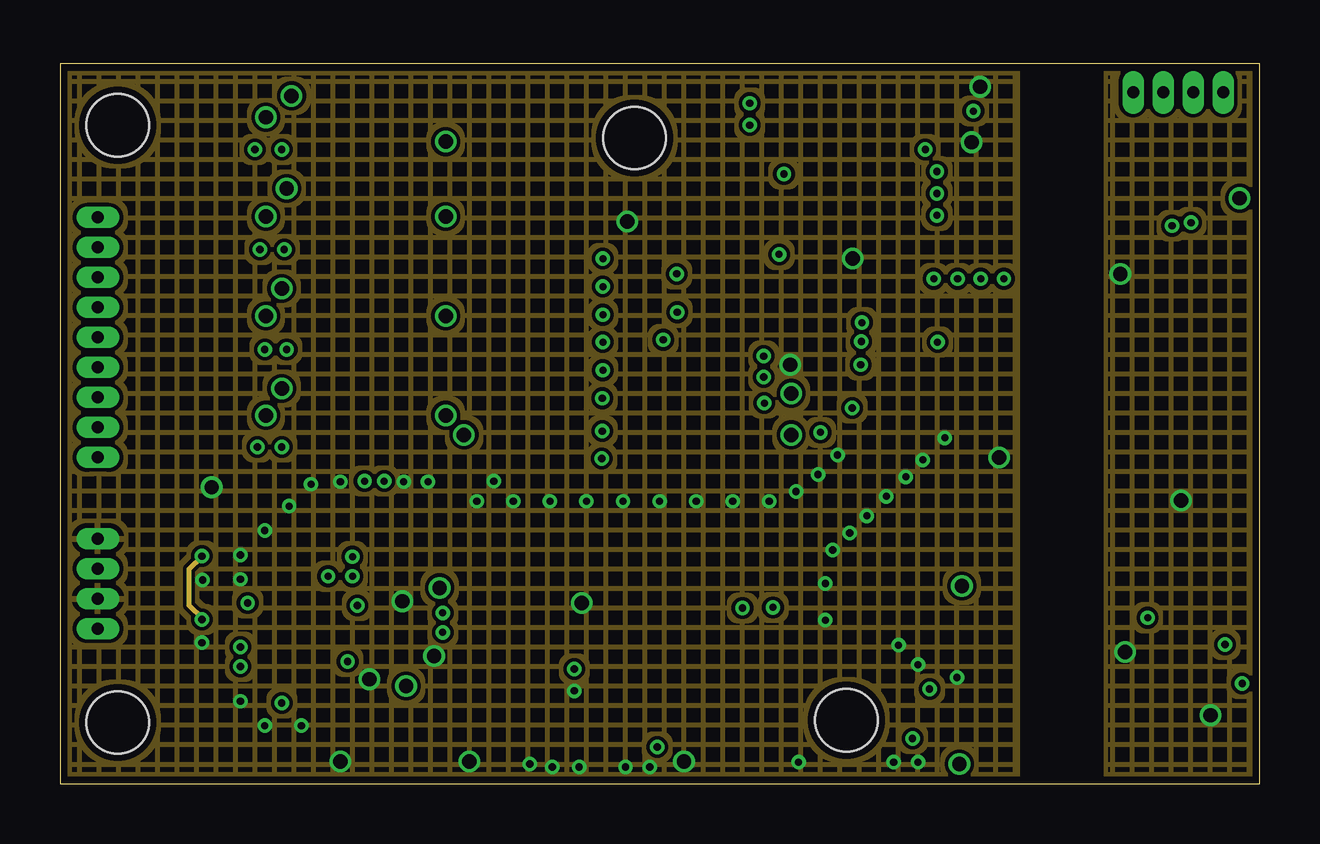
[diagram p8: board, inner layer Route2]
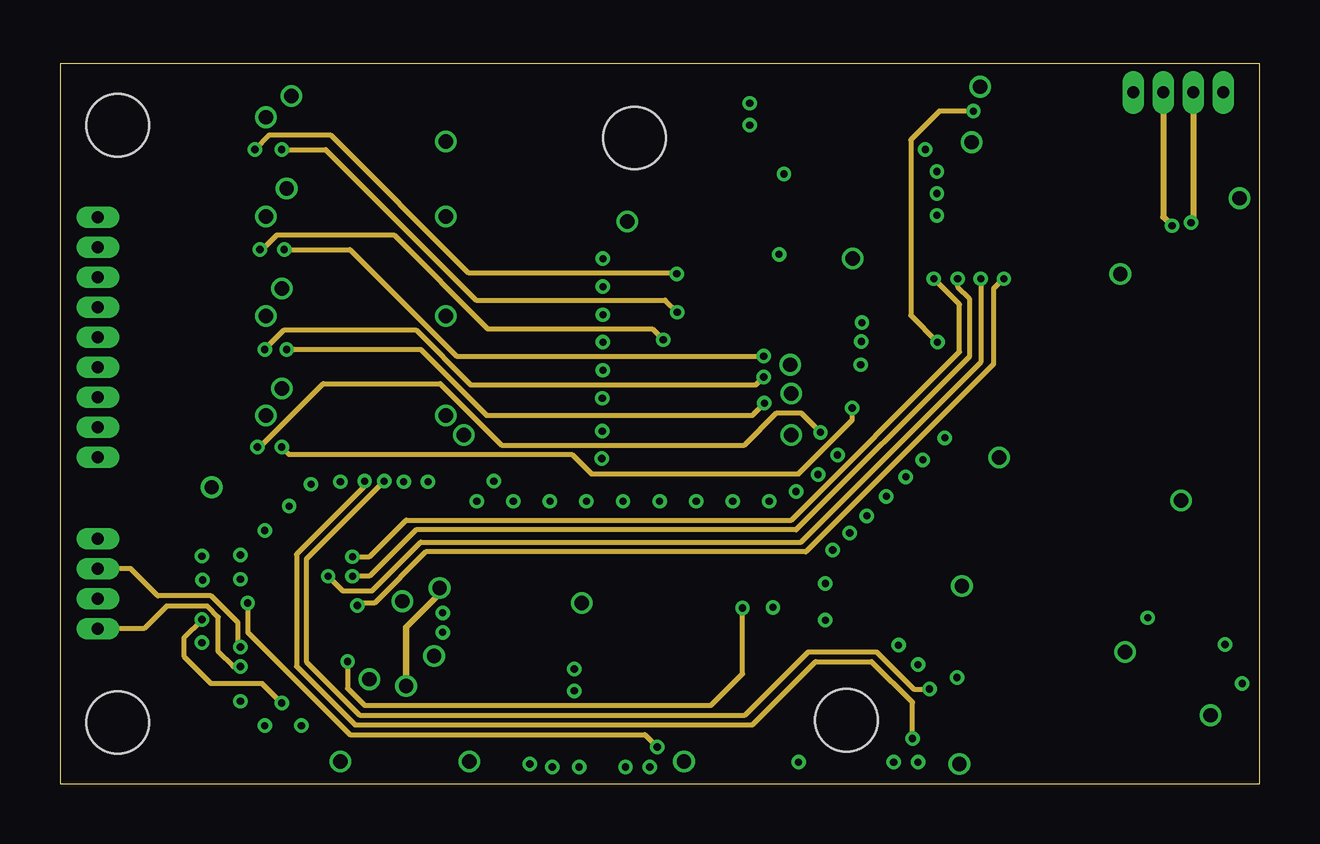
[diagram p9: board, inner layer Route15]
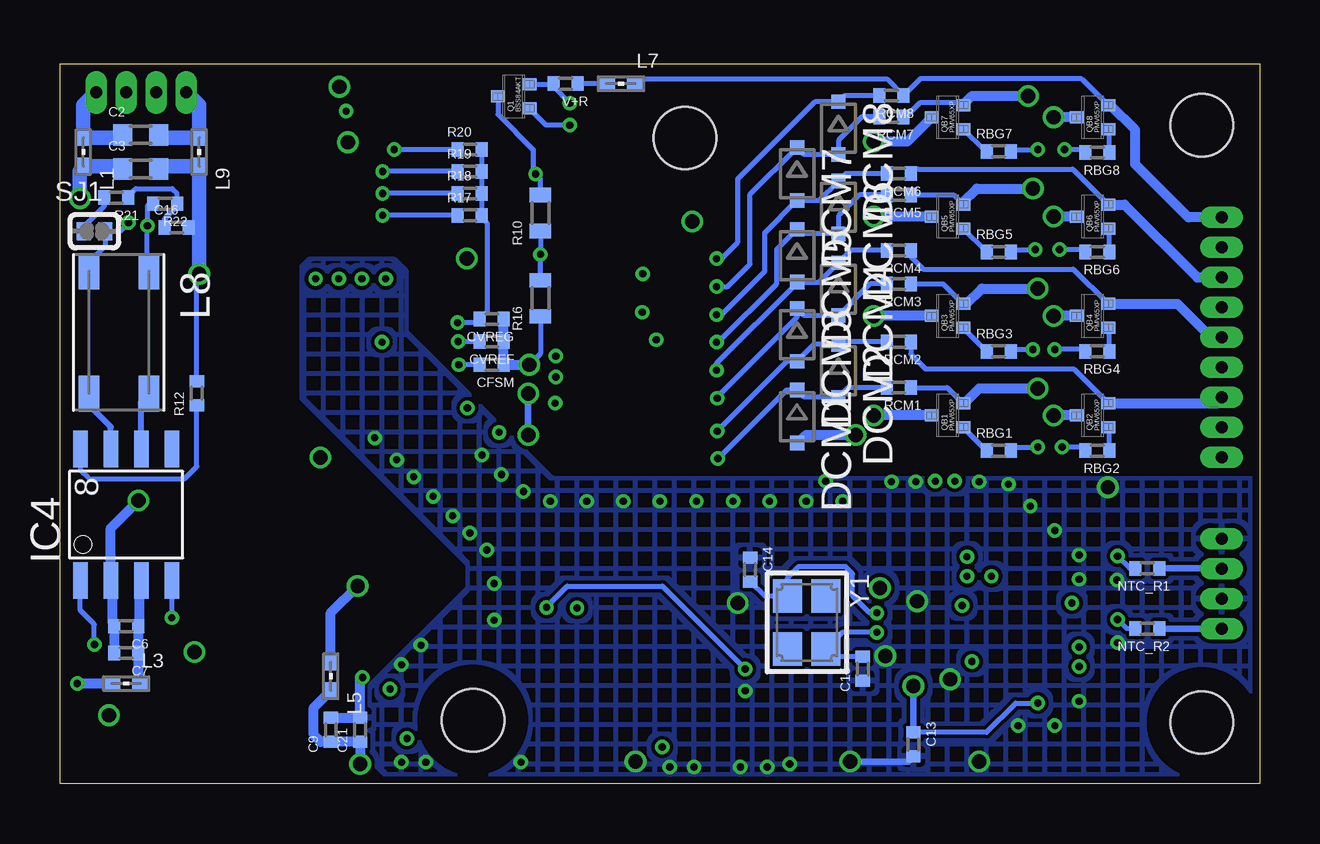
[diagram p10: board, bottom side, seen from below]

Size 50 x 30 mm. Coordinates in mm from the lower left corner, seen from the top.
Outline: 0,0 50,0 50,30 0,30 0,0
Copper layers (1+2*15+16): Top 0.035mm / dielectric 0.38mm / Route2 0.035mm / dielectric 0.71mm / Route15 0.035mm / dielectric 0.38mm / Bottom 0.035mm
Design rules "PCB-POOL Standard_ML4 *": minimum track width 8mil, minimum drill 0.3mm, track to track 0.15mm, track to pad 0.15mm, pad to pad 0.15mm, via to via 0.15mm, smd to smd 0.15mm, copper to edge 0.3mm, drill to drill 0.2mm, minimum pad ring 0.2mm, minimum via ring 0.15mm, stop-mask expansion 0.075mm, vias tented up to drill 30mil, thermal gap 0.2mm
Holes 2.6 mm at 2.4,2.54 2.4,27.43 23.94,26.9 32.78,2.64
tRestrict: area 0.3,0.4 to 4.5,4.6; area 0.3,25.3 to 4.5,29.5; area 21.8,24.8 to 26,29; area 30.7,0.5 to 34.9,4.7
bRestrict: area 0.3,0.4 to 4.5,4.6; area 0.3,25.3 to 4.5,29.5; area 21.8,24.8 to 26,29; area 30.7,0.5 to 34.9,4.7

### Footprints (pad centres in the part's own frame; a part is rotated, then mirrored left to right if it is on the bottom)
C1206 = smd 1 x 1.8: 1 -1.4,0; 2 1.4,0
C0603 = smd 0.8 x 0.9: 1 -0.75,0; 2 0.75,0
C0402 = smd 0.5 x 0.6: 1 -0.5,0; 2 0.5,0
SOD323-R = smd 0.6 x 0.6: A 1.1,0; C -1.1,0
ISF = smd 1.2 x 2: 1 -3.81,-4.75; 2 -1.27,-4.75; 4 3.81,-4.75; 5 3.81,4.75; 8 -3.81,4.75
LQFP48 = smd 0.28 x 1.5: 1 -2.75,-4.425; 2 -2.25,-4.425; 3 -1.75,-4.425; 4 -1.25,-4.425; 5 -0.75,-4.425; 6 -0.25,-4.425; 7 0.25,-4.425; 8 0.75,-4.425; 9 1.25,-4.425; 10 1.75,-4.425; 11 2.25,-4.425; 12 2.75,-4.425; 25 2.75,4.425; 26 2.25,4.425; 27 1.75,4.425; 28 1.25,4.425; 29 0.75,4.425; 30 0.25,4.425; 31 -0.25,4.425; 32 -0.75,4.425; 33 -1.25,4.425; 34 -1.75,4.425; 35 -2.25,4.425; 36 -2.75,4.425 | smd 1.5 x 0.28: 13 4.425,-2.75; 14 4.425,-2.25; 15 4.425,-1.75; 16 4.425,-1.25; 17 4.425,-0.75; 18 4.425,-0.25; 19 4.425,0.25; 20 4.425,0.75; 21 4.425,1.25; 22 4.425,1.75; 23 4.425,2.25; 24 4.425,2.75; 37 -4.425,2.75; 38 -4.425,2.25; 39 -4.425,1.75; 40 -4.425,1.25; 41 -4.425,0.75; 42 -4.425,0.25; 43 -4.425,-0.25; 44 -4.425,-0.75; 45 -4.425,-1.25; 46 -4.425,-1.75; 47 -4.425,-2.25; 48 -4.425,-2.75
44SSOP = smd 1.6 x 0.28: 1 -3.6,5.25; 2 -3.6,4.75; 3 -3.6,4.25; 4 -3.6,3.75; 5 -3.6,3.25; 6 -3.6,2.75; 7 -3.6,2.25; 8 -3.6,1.75; 9 -3.6,1.25; 10 -3.6,0.75; 11 -3.6,0.25; 12 -3.6,-0.25; 13 -3.6,-0.75; 14 -3.6,-1.25; 15 -3.6,-1.75; 16 -3.6,-2.25; 17 -3.6,-2.75; 18 -3.6,-3.25; 19 -3.6,-3.75; 20 -3.6,-4.25; 21 -3.6,-4.75; 22 -3.6,-5.25; 23 3.6,-5.25; 24 3.6,-4.75; 25 3.6,-4.25; 26 3.6,-3.75; 27 3.6,-3.25; 28 3.6,-2.75; 29 3.6,-2.25; 30 3.6,-1.75; 31 3.6,-1.25; 32 3.6,-0.75; 33 3.6,-0.25; 34 3.6,0.25; 35 3.6,0.75; 36 3.6,1.25; 37 3.6,1.75; 38 3.6,2.25; 39 3.6,2.75; 40 3.6,3.25; 41 3.6,3.75; 42 3.6,4.25; 43 3.6,4.75; 44 3.6,5.25
SO-8 = smd 1.524 x 0.61: 1 -2.743,1.905; 2 -2.743,0.635; 3 -2.743,-0.635; 4 -2.743,-1.905; 5 2.743,-1.905; 6 2.743,-0.635; 7 2.743,0.635; 8 2.743,1.905
2X03_1.27MM_SMT = smd 0.65 x 2.6: 1 -1.27,-1.85; 2 -1.27,1.85; 3 0,-1.85; 4 0,1.85; 5 1.27,-1.85; 6 1.27,1.85
0402 = smd 0.7 x 0.6: 1 -0.6,0; 2 0.6,0
WE-SL1 = smd 1.5 x 0.85: 1 -2.55,-1.25; 3 -2.55,1.25; 4 2.55,1.25; 5 2.55,-1.25
CHIP-LED0603 = smd 0.8 x 0.8: A 0,-0.75; C 0,0.75
R0402 = smd 0.5 x 0.6: 1 -0.5,0; 2 0.5,0
SOT416 = smd 0.5 x 0.6: 1 -0.5,-0.65; 2 0.5,-0.65; 3 0,0.65
R0603 = smd 0.6 x 0.9: 1 -0.75,0; 2 0.75,0
R2512 = smd 1.8 x 3.2: 1 -2.8,0; 2 2.8,0
SOLDERJUMPER_REFLOW_NOPASTE_SMALL = smd 0.584 x 0.762: 1 -0.445,0; 2 0.445,0
SOT223-R = smd 1.3 x 1.3: 1 -2.3,-3.05; 2 0,-3.05; 3 2.3,-3.05 | smd 3.6 x 1.3: 4 0,3.05
53047-09 = drill 0.5 pad 0.698 long: 1 5,0.45; 2 3.75,0.45; 3 2.5,0.45; 4 1.25,0.45; 5 0,0.45; 6 -1.25,0.45; 7 -2.5,0.45; 8 -3.75,0.45; 9 -5,0.45
53047-04 = drill 0.5 pad 0.698 long: 1 1.875,0.45; 2 0.625,0.45; 3 -0.625,0.45; 4 -1.875,0.45
CRYSTAL_3.2X2.5 = smd 1.4 x 1.2: 1 -1.1,-0.8; 2 1.1,0.8; GND1 -1.1,0.8; GND2 1.1,-0.8

### Placement (x,y rotation side)
C1  23.88,23.42 180 top
C2  46.63,27.03 0 bottom
C3  46.63,25.6 0 bottom
C4  33.83,6.81 180 top
C5  33.83,8.33 180 top
C6  47.24,6.55 180 bottom
C7  47.24,5.44 180 bottom
C8  47.75,1.22 90 top
C9  38.71,2.24 90 bottom
C10  15.54,0.91 0 top
C11  20.22,7.52 0 top
C12  20.22,8.43 0 top
C13  14.43,1.63 270 bottom
C14  21.23,8.92 270 bottom
C15  16.54,4.78 90 bottom
C16  45.14,23.16 0 bottom
C18  46.53,1.22 90 top
C19  48.77,16.76 270 top
C21  37.49,2.24 90 bottom
C22  13.31,0.91 180 top
C23  20.22,6.6 0 top
C24  20.09,4.17 0 top
CCM1  24.38,12.95 270 top
CCM2  23.47,14.15 270 top
CCM3  24.38,15.34 270 top
CCM4  23.47,16.54 270 top
CCM5  24.38,17.73 270 top
CCM6  23.47,18.92 270 top
CCM7  24.38,20.12 270 top
CCM8  23.47,21.31 270 top
CFSM  32,17.45 180 bottom
CVREF  32,18.41 180 bottom
CVREG  32,19.35 180 bottom
D1  35.88,26.72 0 top
D2  27.18,28.12 270 top
DCDC1  42.96,11.05 180 top
DCM1  19.28,15.29 270 bottom
DCM2  17.55,17.2 270 bottom
DCM3  19.28,18.69 270 bottom
DCM4  17.55,20.6 270 bottom
DCM5  19.28,22 270 bottom
DCM6  17.55,24 270 bottom
DCM7  19.28,25.4 270 bottom
DCM8  17.55,27.3 270 bottom
IC1  13.67,6.78 90 top
IC2  31.41,20.12 0 top
IC3  41.69,2.51 180 top
IC4  47.24,11.2 90 bottom
JP2  28.45,3.66 180 top
L1  49.02,26.31 90 bottom
L2  35.86,7.62 270 top
L3  47.24,4.17 180 bottom
L4  48.97,1.42 90 top
L5  38.71,4.47 90 bottom
L6  20.62,9.55 0 top
L7  26.62,29.16 180 bottom
L8  47.55,18.8 270 bottom
L9  44.2,26.31 90 bottom
LED2  22.48,2.11 180 top
NTC_C1  4.67,8.97 0 top
NTC_C2  4.67,6.45 0 top
NTC_R1  4.67,8.97 180 bottom
NTC_R2  4.67,6.45 180 bottom
Q1  31.09,28.63 90 bottom
Q2  35.51,28.52 90 top
Q3  19.08,2.39 0 top
QB1  13,15.34 90 bottom
QB2  6.96,15.34 90 bottom
QB3  13,19.48 90 bottom
QB4  6.96,19.48 90 bottom
QB5  13,23.62 90 bottom
QB6  6.96,23.62 90 bottom
QB7  13,27.76 90 bottom
QB8  6.96,27.76 90 bottom
R1  39.34,22.25 90 top
R2  36.75,19.74 270 top
R3  36.42,22.25 90 top
R4  38.38,22.25 90 top
R5  37.41,22.25 90 top
R6  36.78,1.88 0 top
R7  36.78,3.15 0 top
R8  20.83,2.34 270 top
R9  30.45,8.38 180 top
R10  29.97,23.77 90 bottom
R11  16.66,12.6 180 top
R12  44.3,16.26 90 bottom
R13  47.04,3.35 270 top
R14  46.02,3.35 270 top
R15  22.48,4.37 90 top
R16  29.97,20.22 90 bottom
R17  32.92,23.67 0 bottom
R18  32.92,24.59 0 bottom
R19  32.92,25.5 0 bottom
R20  32.92,26.42 0 bottom
R21  47.65,24.41 180 bottom
R22  45.62,24.16 180 bottom
RBG1  10.87,13.87 0 bottom
RBG2  6.76,13.87 180 bottom
RBG3  10.87,18.01 0 bottom
RBG4  6.76,18.01 180 bottom
RBG5  10.87,22.15 0 bottom
RBG6  6.76,22.15 180 bottom
RBG7  10.87,26.34 0 bottom
RBG8  6.76,26.29 180 bottom
RCM1  15.04,16.5 180 bottom
RCM2  15.04,18.4 180 bottom
RCM3  15.04,20.82 180 bottom
RCM4  15.04,22.21 180 bottom
RCM5  15.04,24.52 180 bottom
RCM6  15.04,25.41 180 bottom
RCM7  15.34,27.77 180 bottom
RCM8  15.34,28.66 180 bottom
RGQ1_1  30.61,28.96 0 top
RGQ1_2  33.15,28.96 180 top
RGQ1_3  37.19,28.52 270 top
RP1  17.37,15.34 0 top
RP2  8.99,15.34 0 top
RP3  17.37,19.48 0 top
RP4  8.99,19.48 0 top
RP5  17.37,23.62 0 top
RP6  8.99,23.62 0 top
RP7  17.37,27.76 0 top
RP8  8.99,27.76 0 top
SJ1  48.56,23.01 0 bottom
U1  46.53,22.35 0 top
U$14  [SMLOGOP]  24.89,7.72 0 top
V+R  28.93,29.16 180 bottom
V-R  4.83,12.34 0 top
X1  2.03,18.59 90 top
X2  2.03,8.33 90 top
X3  46.61,28.35 0 top
Y1  18.87,6.71 270 bottom

### Tracks (layer width: path | path; a pad name or v marks a point on that pad's centre or on a via)
!RESET  (via drill 0.3)
  Top 0.203: IC1.3 19.51,5.03 | 19.51,5.03 21.18,5.03 v21.44,4.78 | JP2.1 v29.72,7.34 29.72,8.14 R9.2 | C24.1 19.59,4.95 19.51,5.03
  Bottom 0.203: v21.44,4.78 24.89,8.23 28.85,8.23 29.72,7.37 v29.72,7.34
+3V3  (via drill 0.3, 0.6)
  Top 0.203: Q2.1 RGQ1_3.2 v38.07,28.02 v38.08,28.02 | IC2.30 36.55,18.37 v36.58,18.39 37.49,17.48 37.49,8.23 37.59,8.13 v37.59,8.23 L2.1 35.76,8.33 34.85,8.33 34.75,8.43 34.65,8.43 34.58,8.5 | JP2.2 29.72,3.1 | 29.72,3.1 28.96,3.86 23.48,3.86 LED2.A R15.1 | R9.1 30.95,8.2 30.79,8.03 30.79,4.17 29.72,3.1
  Top 0.254: 34.85,8.33 C5.1 34.58,8.5 33.93,9.14 31.72,9.14 R9.1 28.26,11.07 22.76,11.07 21.34,9.65 L6.2
  Top 0.406: L2.1 v37.58,8.22 v37.59,8.23
  Top 0.61: 34.85,8.33 35.75,8.33 L2.1
  Route15 0.203: v38.08,28.02 36.65,28.02 35.46,26.82 35.46,19.51 v36.58,18.39
  Bottom 0.406: L5.2 38.71,7.11 v37.59,8.23
+3V3_AD  (via drill 0.6)
  Top 0.61: IC3.8 37.69,0.61 v37.49,0.81
  Bottom 0.406: v37.49,0.81 C21.1 C9.1 39.12,1.74 39.42,2.03 39.42,3.16 L5.1
+3V3_UC  (via drill 0.3, 0.6)
  Top 0.203: C12.1 19.72,9.24 L6.1
  Top 0.279: C22.1 14.43,0.91 | 14.43,0.91 C10.1 | 14.43,0.91 14.41,0.93 IC1.44 14.41,4.05 v14.43,4.06 | C11.1 19.7,7.53 IC1.8 16.45,7.53 v15.82,8.15 | C12.1 C11.1 | C11.1 C23.1
  Route2 0.203: v5.92,6.83 5.92,6.88 5.38,7.42 5.38,8.94 v5.92,9.47
  Route15 0.203: v9.25,3.35 8.43,4.17 6.3,4.17 5.18,5.28 5.18,6.1 v5.92,6.83
  Route15 0.279: v15.82,8.15 15.82,7.9 14.43,6.5 v14.43,4.06
  Bottom 0.203: C13.1 11.38,2.13 10.16,3.35 v9.25,3.35 | NTC_R1.2 5.41,8.97 v5.92,9.47 | NTC_R2.2 5.54,6.45 v5.92,6.83
  Bottom 0.279: C13.1 v14.43,4.06
+3V3DCOUT
  Top 0.61: C4.1 35.65,6.81 L2.2 38.42,7.02 DCDC1.5
ACTIVE_LED
  Top 0.203: Q3.1 16.47,1.74 16.46,1.73 16.46,2.31 IC1.48
AD1  (via drill 0.3)
  Top 0.203: IC1.33 7.68,5.53 v7.52,5.69
  Top 0.279: X2.2 4.16,8.96 NTC_C1.1
  Route15 0.203: v7.52,5.69 7.42,5.79 7.42,6.71 6.3,7.82 4.08,7.82 2.95,8.96 X2.2
  Bottom 0.279: NTC_C1.1 1.59,8.97 X2.2
AD2  (via drill 0.3)
  Top 0.203: IC1.34 7.67,5.03 v7.52,4.88
  Top 0.279: X2.4 NTC_C2.1
  Route15 0.203: v7.52,4.88 7.21,4.88 6.6,5.49 6.6,6.93 6.15,7.39 4.44,7.39 3.5,6.46 X2.4
  Bottom 0.279: NTC_C2.1 X2.4
BAL1  (via drill 0.3)
  Top 0.203: IC2.25 33.24,15.87 v33.02,15.65
  Route15 0.203: v9.25,14.02 9.55,13.72 21.34,13.72 22.15,12.9 30.79,12.9 33.02,15.14 v33.02,15.65
  Bottom 0.203: RBG1.2 10.31,13.87 10.26,14.02 v9.25,14.02
BAL2  (via drill 0.3)
  Top 0.203: v31.7,14.63 32,14.33 33.63,14.33 34.17,14.87 IC2.23
  Route15 0.203: 8.33,14.02 10.97,16.66 15.85,16.66 18.41,14.1 28.52,14.1 29.87,15.44 30.89,15.44 v31.7,14.63
  Route15 0.254: 8.33,14.02 v8.23,14.02
  Bottom 0.203: RBG2.2 7.32,14.02 v8.23,14.02
BAL3  (via drill 0.3)
  Top 0.203: IC2.21 28.88,15.37 v29.36,15.85
  Route15 0.203: v9.45,18.09 15.04,18.09 17.78,15.34 28.85,15.34 v29.36,15.85
  Bottom 0.203: RBG3.2 10.34,18.01 10.26,18.09 v9.45,18.09
BAL4  (via drill 0.3)
  Top 0.203: IC2.19 28.76,16.37 v29.34,16.94
  Route15 0.203: v8.53,18.09 9.35,18.9 14.83,18.9 17.12,16.61 29.01,16.61 v29.34,16.94
  Bottom 0.203: RBG4.2 7.34,18.01 7.42,18.09 v8.53,18.09
BAL5  (via drill 0.3)
  Top 0.203: IC2.17 28.9,17.37 v29.34,17.8
  Route15 0.203: v9.35,22.25 12.09,22.25 16.54,17.8 v29.34,17.8
  Bottom 0.203: RBG5.2 10.26,22.25 v9.35,22.25
BAL6  (via drill 0.3)
  Top 0.203: IC2.15 25.27,18.37 v25.15,18.49
  Route15 0.203: v8.33,22.25 8.43,22.25 9.04,22.86 13.92,22.86 17.83,18.95 24.69,18.95 v25.15,18.49
  Bottom 0.203: RBG6.2 7.26,22.19 7.32,22.25 v8.33,22.25
BAL7  (via drill 0.3)
  Top 0.203: IC2.13 26,19.37 v25.73,19.63
  Route15 0.203: v9.25,26.42 11.07,26.42 17.35,20.14 25.22,20.14 v25.73,19.63
  Bottom 0.203: RBG7.2 10.34,26.34 10.26,26.42 v9.25,26.42
BAL8  (via drill 0.3)
  Top 0.203: IC2.11 26.57,20.37 v25.7,21.23
  Route15 0.203: v8.13,26.42 8.74,27.03 11.28,27.03 17.02,21.29 25.65,21.29 v25.7,21.23
  Bottom 0.203: RBG8.2 7.29,26.29 7.42,26.42 v8.13,26.42
C0  (via drill 0.6)
  Top 0.203: 14.57,14.37 14.88,14.37 15.04,14.53
  Top 0.279: CCM1.2 28.41,12.45 v30.48,14.53 | IC2.26 30.59,16.37 v30.48,16.26
  Top 0.406: RP1.1 14.57,14.37 13.51,13.31 4.32,13.31 | 4.32,13.31 1.86,13.31 X1.9 | 15.04,14.53 v16.84,14.53 17.68,14.53 19.75,12.45 CCM1.2 | V-R.1 4.33,13.3 4.32,13.31
  Bottom 0.203: DCM1.A 19.24,14.19
  Bottom 0.279: v30.48,14.53 v30.48,16.26
  Bottom 0.406: 19.24,14.19 18.9,14.53 v16.84,14.53
C1  (via drill 0.6)
  Top 0.406: X1.8 5.69,14.84 RP2.1 6.19,16.05 6.6,16.46 v9.25,16.46
  Bottom 0.203: RCM1.1 13.01,16.5 QB1.2
  Bottom 0.406: QB1.2 12.3,15.84 11.68,16.46 v9.25,16.46
C1M  (via drill 0.3)
  Top 0.203: CCM2.2 23.43,13.65 23.42,13.54 v22.58,13.54
  Top 0.279: CCM2.2 23.66,13.45 CCM1.1 28.29,13.45 30.2,15.37 | 30.2,15.37 | 30.2,15.37 32.08,15.37 32.51,14.94 33.33,14.94 33.76,15.37 IC2.24
  Bottom 0.203: RCM1.2 17.15,16.5 DCM2.A 18.98,16.1 DCM1.C 19.73,16.39 v22.58,13.54
C2
  Top 0.406: X1.7 3.54,16.09 4.85,17.4 13.23,17.4 14.57,18.74 RP3.1
  Bottom 0.203: RCM2.1 14.54,17.89 13.92,17.27 7.74,17.27 QB2.2
  Bottom 0.406: QB2.2 1.76,15.84 1.51,16.09 X1.7
C2M  (via drill 0.3)
  Top 0.203: CCM2.1 23.5,14.68 v22.61,14.68
  Top 0.279: IC2.22 24.41,14.87 CCM3.2 23.66,14.84 CCM2.1
  Bottom 0.203: RCM2.2 17.45,18.4 DCM2.C 18.58,18.3 DCM3.A 19.69,17.59 v22.61,14.68
C3  (via drill 0.6)
  Top 0.406: X1.6 3.63,17.34 5.38,19.1 5.81,19.1 RP4.1 6.19,20.31 6.5,20.62 v9.25,20.62
  Bottom 0.203: RCM3.1 13.19,20.82 QB3.2
  Bottom 0.406: QB3.2 12.22,19.98 11.58,20.62 v9.25,20.62
C3M  (via drill 0.3)
  Top 0.203: CCM4.2 23.41,16.04 23.39,16.05 v22.61,16.05
  Top 0.279: IC2.20 24.41,15.87 CCM3.1 23.66,15.84 CCM4.2
  Bottom 0.203: RCM3.2 16.23,20.82 DCM4.A 18.98,19.5 DCM3.C 19.28,19.43 22.61,16.1 v22.61,16.05
C4
  Top 0.406: RP5.1 14.57,22.8 13.34,21.57 5,21.57 2.03,18.59 X1.5
  Bottom 0.203: RCM4.1 14.54,21.95 14.02,21.44 7.76,21.44 QB4.2
  Bottom 0.406: QB4.2 3.42,19.98 2.08,18.64 1.63,18.64 X1.5
C4M  (via drill 0.3)
  Top 0.203: CCM4.1 23.45,17.04 23.44,17.04 23.42,17.04 23.24,17.22 v22.63,17.22
  Top 0.279: IC2.18 24.75,16.87 CCM5.2 23.66,17.23 CCM4.1
  Bottom 0.203: RCM4.2 17.04,22.21 DCM4.C 18.35,20.9 DCM5.A 19.28,20.85 22.63,17.5 v22.63,17.22
C5  (via drill 0.6)
  Top 0.406: X1.4 2.27,19.84 5.38,22.96 5.53,22.96 RP6.1 6.19,24.28 6.71,24.79 v9.45,24.79
  Bottom 0.203: RCM5.1 12.76,24.52 QB5.2
  Bottom 0.406: QB5.2 12.36,24.22 11.79,24.79 v9.45,24.79
C5M  (via drill 0.3)
  Top 0.203: CCM6.2 23.39,18.42 23.34,18.39 v22.63,18.39
  Top 0.279: IC2.16 24.75,17.87 CCM5.1 23.66,18.23 CCM6.2
  Bottom 0.203: RCM5.2 16.68,24.52 17.55,23.65 DCM6.A 19.09,22.9 DCM5.C 20.12,22.26 20.12,20.83 22.5,18.44 v22.63,18.39
C6
  Top 0.406: X1.3 2.4,21.09 4.57,23.27 4.57,25.17 5.08,25.68 13.23,25.68 14.57,27.02 RP7.1
  Bottom 0.203: RCM6.1 14.54,25.61 14.22,25.6 7.79,25.6 QB6.2
  Bottom 0.406: QB6.2 5.63,24.12 2.6,21.09 X1.3
C6M  (via drill 0.3)
  Top 0.203: CCM6.1 23.45,19.42 23.44,19.53 v22.63,19.53
  Top 0.279: IC2.14 25.64,18.87 25.09,19.41 24.88,19.62 CCM7.2 24.19,19.42 CCM6.1
  Bottom 0.203: RCM6.2 17.24,25.41 DCM6.C 18.35,24.3 DCM7.A 20.62,22.95 20.62,21.34 22.43,19.53 v22.63,19.53
C7  (via drill 0.6)
  Top 0.406: X1.2 2.46,22.34 3.79,23.67 3.79,25.27 6.17,27.63 | RP8.1 6.17,27.63 | 6.17,27.63 6.19,28.44 6.4,28.65 v9.65,28.65
  Bottom 0.203: QB7.2 12.39,28.25 12.39,28.36 14.15,28.36 14.73,27.79 14.73,27.77 RCM7.1
  Bottom 0.406: QB7.2 12.36,28.29 11.99,28.65 v9.65,28.65
C7M  (via drill 0.3)
  Top 0.203: CCM8.2 23.38,20.81 23.37,20.7 v22.63,20.7
  Top 0.279: IC2.12 26.46,19.87 25.71,20.62 CCM7.1 23.66,20.62 CCM8.2
  Bottom 0.203: RCM7.2 16.57,27.77 17.55,26.8 DCM8.A 18.98,26.2 DCM7.C 21.23,24.54 21.23,21.64 22.17,20.7 v22.63,20.7
C8
  Bottom 0.203: QB8.2 7.41,29.36 14.14,29.36 RCM8.1 15.54,29.36 25.7,29.36 25.91,29.16 L7.1
  Bottom 0.406: X1.1 2.97,23.59 5.18,25.81 5.18,27.24 6.2,28.25 6.2,28.26 QB8.2
C8F
  Bottom 0.203: L7.2 V+R.1
C8M  (via drill 0.3)
  Top 0.203: IC2.10 26.68,20.87 26.42,21.13 26.42,21.87 | 26.42,22.86 26.42,21.87 | IC2.6 26.42,22.87 26.42,22.86 | IC2.8 26.42,21.87 | IC2.2 26.64,24.87 26.42,24.64 26.42,23.85 | 26.42,23.85 26.42,22.86 | IC2.4 26.43,23.87 26.42,23.85 | 23.53,21.87 22.66,21.87 v22.63,21.87
  Top 0.279: 26.42,21.87 23.53,21.87 CCM8.1
  Bottom 0.203: RCM8.2 17.29,28.66 DCM8.C 18.53,28.41 21.74,25.2 21.74,22.55 22.43,21.87 v22.63,21.87
CANH  (via drill 0.3)
  Route15 0.254: X3.2 47.24,23.48 v47.14,23.37
  Bottom 0.203: L8.1 48.8,21.71 48.12,22.39 SJ1.2 47.5,23.01 v47.14,23.37
CANHL
  Bottom 0.254: IC4.7 47.88,14.86 48.8,15.78 L8.5
CANJ
  Bottom 0.203: SJ1.1 49.01,23.2 48.15,24.06 R21.2
CANL  (via drill 0.3)
  Route15 0.254: X3.3 45.99,23.61 v46.35,23.24
  Bottom 0.203: L8.3 46.35,21.4 v46.35,23.24 46.35,24.05 46.25,24.16 R22.2
CANLL
  Bottom 0.254: IC4.6 46.61,15.94 L8.4
CANRX
  Top 0.203: IC3.6 R7.2
CANRX_U  (via drill 0.3)
  Top 0.203: IC1.19 13.41,12.5 v13.51,12.6 | R7.1 36.28,3.9 v36.25,3.94
  Route15 0.203: v13.51,12.6 10.26,9.35 10.26,5.08 12.5,2.85 28.55,2.85 31.19,5.49 34.04,5.49 35.59,3.94 v36.25,3.94
CANT
  Bottom 0.203: R21.1 47.15,24.48 46.84,24.79 45.31,24.79 45.12,24.59 R22.1 45.12,24.05 45.64,23.53 C16.1
CANTX
  Top 0.203: IC3.7 R6.2
CANTX_U  (via drill 0.3)
  Top 0.203: IC1.20 12.91,12.38 v12.7,12.6 | R6.1 v35.53,1.88
  Route15 0.203: v12.7,12.6 12.7,12.39 9.86,9.55 9.86,4.88 12.29,2.44 28.85,2.44 31.5,5.08 33.83,5.08 35.53,3.38 v35.53,1.88
CAR+5V  (via drill 0.3)
  Top 0.406: C19.1 48.17,17.26 46.94,18.49 | L4.2 48.97,2.23 49.28,2.54 v49.28,4.17 49.28,6.4 44.23,11.45 DCDC1.2
  Top 0.61: DCDC1.2 44.23,16.39 46.33,18.49 46.33,19.1 U1.2 46.53,19 46.74,18.8
  Bottom 0.406: L3.2 v49.28,4.17
  pour Top (no thermals): 45.72,18.19 45.72,21.34 43.69,23.37 43.69,27.53 49.58,27.53 49.58,23.16 47.35,20.93 47.35,18.19
CAR+5V_AD
  Top 0.406: IC3.1 46.42,0.61 C18.1 C8.1 48.87,0.72 L4.1
CAR+5V_CT
  Bottom 0.406: 46.69,8.23 46.61,8.31 IC4.3 46.69,8.38 46.69,6.78 46.74,6.72 C6.1 C7.1 46.74,4.27 L3.1
CAR+12V  (via drill 0.6)
  Top 0.61: U1.3 48.83,19.17 49.17,19.61 v49.17,24.38
  Bottom 0.61: C3.1 47.5,25.71 L1.1 49.02,25.65 49.17,25.5 v49.17,24.38
CAR+12VIN
  Bottom 0.61: X3.1 49.02,28.26 L1.2 47.5,26.91 C2.1
CAR_CANRX
  Top 0.203: R14.2 45.31,2.85 45.01,3.15 IC3.3
CAR_CANRX_T  (via drill 0.3)
  Top 0.203: R14.1 46.02,4.6 45.34,5.28 v45.34,6.91
  Bottom 0.203: IC4.4 v45.34,6.91
CAR_CANTX
  Top 0.203: IC3.2 44.96,1.88 45.41,2.34 46.52,2.34 R13.2
CAR_CANTX_T  (via drill 0.3)
  Top 0.203: R13.1 47.74,3.85 48.56,4.67 v48.56,5.79
  Bottom 0.203: v48.56,5.79 48.56,6.63 49.15,7.21 IC4.1
CARGND  (via drill 0.6)
  Top 0.406: C19.2 47.23,16.26 DCDC1.1 | IC3.4 44.43,4.44 44.4,4.47 v44.4,5.49 | v47.95,2.85 47.95,1.93 C8.2 C18.2
  Top 0.61: v44.2,21.23 44.2,19.34 U1.1 | DCDC1.1 46.77,15.27 46.74,15.24 v46.74,11.79
  Bottom 0.203: C16.2 44.2,23.16 | R12.2 44.3,21.13 v44.2,21.23
  Bottom 0.406: v46.74,11.79 47.88,10.64 IC4.2 47.8,8.38 47.8,6.73 47.74,6.67 C6.2 C7.2
  Bottom 0.61: C3.2 45.77,25.71 L9.1 44.2,23.16 v44.2,21.23
  pour Route2 (hatched): 43.59,0.1 49.99,0.1 49.99,29.97 43.59,29.97
CARGNDIN
  Bottom 0.61: X3.4 44.2,28.25 L9.2 45.77,26.91 C2.2
CR1  (via drill 0.6)
  Top 0.406: RP1.2 v16.08,15.34
  Bottom 0.406: QB1.3 v16.08,15.34
CR2  (via drill 0.6)
  Top 0.406: RP2.2 v8.59,15.34
  Bottom 0.406: QB2.3 v8.59,15.34
CR3  (via drill 0.6)
  Top 0.406: RP3.2 v16.08,19.48
  Bottom 0.406: QB3.3 v16.08,19.48
CR4  (via drill 0.6)
  Top 0.406: RP4.2 v8.59,19.48
  Bottom 0.406: QB4.3 v8.59,19.48
CR5  (via drill 0.6)
  Top 0.406: RP5.2 v16.08,23.62
  Bottom 0.406: QB5.3 v16.08,23.62
CR6  (via drill 0.6)
  Top 0.406: RP6.2 v8.59,23.62
  Bottom 0.406: QB6.3 v8.59,23.62
CR7  (via drill 0.6)
  Top 0.406: RP7.2 20.22,27.64 20.22,26.75 v16.08,26.75
  Bottom 0.406: QB7.3 13.66,27.76 14.68,26.75 v16.08,26.75
CR8  (via drill 0.6)
  Top 0.406: RP8.2 v8.59,27.76
  Bottom 0.406: QB8.3 v8.59,27.76
CSB  (via drill 0.3)
  Top 0.203: IC2.44 35.53,25.37 36.07,25.91 v36.07,26.42 36.42,26.06 37.24,26.06 39.34,23.95 R1.2
  Bottom 0.203: R20.1 v36.07,26.42
FSM  (via drill 0.3)
  Top 0.203: IC2.29 33.79,17.87 v33.38,17.45 CFSM.2 29.97,19.98 v29.97,22.05
  Bottom 0.203: CFSM.2 v33.38,17.45 | R10.1 v29.97,22.05 R16.2
GND  (via drill 0.3, 0.6)
  Top 0.203: Q2.2 RGQ1_3.1 | IC2.27 31.01,16.87 v30.43,17.45 | v33.05,21.87 33.05,21.92 33.02,21.95 | Q3.2 v19.57,0.82 v19.58,0.81 | C24.2 20.59,4.1 20.83,3.86 v21.44,3.86 | R11.1 v18.09,12.6
  Top 0.279: IC2.40 33.32,23.37 33.02,23.06 33.02,22.86 | 33.02,20.83 33.02,20.22 33.37,19.87 IC2.33 | 33.02,20.83 33.02,21.34 | 33.02,21.34 33.02,21.95 | 33.02,21.95 33.02,22.35 | 33.02,22.35 33.02,22.86 | IC2.35 33.06,20.87 33.02,20.83 | IC2.36 33.05,21.37 33.02,21.34 | IC2.37 33.1,21.87 33.02,21.95 | IC2.38 33.03,22.37 33.02,22.35 | IC2.39 33.04,22.87 | 33.02,22.86 33.03,22.87 33.04,22.87 | 33.04,22.87 33.05,22.86 | C1.2 v23.65,23.42 | JP2.6 27.07,0.92 v26.01,0.91 | IC1.41 12.91,4.33 v12.9,4.34 | IC1.5 16.73,6.03 16,5.31 v15.6,5.31 | NTC_C1.2 5.46,8.97 v5.94,8.48 | NTC_C2.2 5.33,6.45 v5.92,5.87 | C22.2 v11.68,0.91 | C10.2 v17.07,0.91 | C23.2 C11.2 | C11.2 v21.74,7.52 | C12.2 C11.2
  Top 0.406: V-R.2 v6.33,12.34 | RGQ1_3.1 38.04,29.02 v38.35,29.03 | D1.A v38,26.72
  Top 0.61: C4.2 v31.9,6.81 | C5.2 v31.9,8.33 | IC3.5 v37.39,4.42
  Top 0.813: DCDC1.4 v39.15,13.59 v39.14,13.59
  Bottom 0.203: R16.1 29.97,17.91 v30.43,17.45
  Bottom 0.279: v17.07,0.91 14.64,0.91 C13.2
  Bottom 0.406: v30.43,17.45 CFSM.1 CVREF.1 CVREG.1 | v37.39,4.42 37.49,4.32 C21.2 C9.2
  other vias: 14.27,7.59 36.88,14.4 35.97,13.49 35.26,12.78 34.44,11.96 33.63,11.15 32.92,10.44 32.21,9.73 29.57,11.76 30.68,12.17 31.6,12.88 32.41,13.69 28.04,11.76 26.52,11.76 24.99,11.76 23.47,11.76 21.95,11.76 20.42,11.76 18.9,11.76 17.37,11.76 15.34,12.57 14.33,12.57 11.68,12.57 10.46,12.47 9.55,11.56 8.53,10.54 7.52,9.53 7.52,8.51 7.52,3.43 8.53,2.41 10.06,2.41 35.76,4.95 34.95,5.77 35.76,0.89 20.52,0.69 21.64,0.69 23.57,0.69 24.59,0.69 34.75,0.89 30.78,0.89
  pour Route2 (hatched): 0.1,-0.1 39.93,-0.1 39.93,29.97 0.1,29.97
  pour Bottom (hatched): 0,0 0,12.7 29.46,12.7 35.56,18.8 35.56,21.34 36.07,21.84 39.62,21.84 39.93,21.54 39.93,16.05 33.02,9.14 33.02,8.13 37.08,4.06 37.08,1.02 36.07,0
ISP_CAN
  Top 0.203: IC1.14 15.91,12.35 R11.2
ISP_ENTER
  Top 0.203: IC1.4 21.82,5.53 R15.2 26.93,4.87 27.03,4.78 27.03,5.36 JP2.5
LED1C1
  Top 0.203: R8.2 22,1.84 LED2.C
MISO1  (via drill 0.3)
  Top 0.203: R4.1 v38.38,21.03 | IC1.26 9.74,9.03 9.75,9.04 10.77,9.04 v11.18,8.64
  Route15 0.203: v11.18,8.64 11.79,8.03 13.01,8.03 15.04,10.06 30.89,10.06 38.41,17.58 38.41,21.01 v38.38,21.03
MOSI1  (via drill 0.3)
  Top 0.203: R5.1 v37.41,21.03 | IC1.38 11.41,7.86 v12.19,8.64
  Route15 0.203: v37.41,21.03 37.41,20.7 37.9,20.22 37.9,17.78 30.68,10.57 14.83,10.57 12.9,8.64 v12.19,8.64
Q1G  (via drill 0.3)
  Top 0.203: D2.A 27.22,27.02 27.64,27.43 v28.75,27.43 31.04,27.43 31.36,27.75 RGQ1_1.2 | RGQ1_2.2 RGQ1_1.2 | RGQ1_1.2 31.27,28.96
  Bottom 0.203: v28.75,27.43 29.75,27.43 Q1.1
Q2D
  Top 0.203: RGQ1_2.1 33.9,28.79 34.14,28.55 34.83,28.55 Q2.3
Q3_COL
  Top 0.203: Q3.3 20.63,3.04 R8.1
QBG1
  Bottom 0.203: RBG1.1 11.38,13.87 QB1.1
QBG2
  Bottom 0.203: RBG2.1 6.26,14.79 QB2.1
QBG3
  Bottom 0.203: RBG3.1 11.38,18.01 QB3.1
QBG4
  Bottom 0.203: RBG4.1 6.26,18.93 QB4.1
QBG5
  Bottom 0.203: RBG5.1 11.38,22.15 QB5.1
QBG6
  Bottom 0.203: RBG6.1 6.26,23.07 QB6.1
QBG7
  Bottom 0.203: RBG7.1 11.43,26.34 QB7.1
QBG8
  Bottom 0.203: RBG8.1 6.26,27.21 QB8.1
RS
  Bottom 0.203: IC4.8 49.15,13.08 48.77,12.7 44.81,12.7 44.3,13.21 R12.1
SCK  (via drill 0.3)
  Top 0.203: IC2.41 36.36,23.87 v36.55,23.67 36.55,22.88 R3.2
  Bottom 0.203: R17.1 v36.55,23.67
SCK1  (via drill 0.3)
  Top 0.203: R3.1 v36.42,21.03 | IC1.13 16.41,9.91 15.95,9.45 v12.19,9.45
  Route15 0.203: v12.19,9.45 12.9,9.45 14.43,10.97 30.48,10.97 37.49,17.98 37.49,19.96 v36.42,21.03
SDI  (via drill 0.3)
  Top 0.203: IC2.42 36.33,24.37 v36.55,24.59 37.21,24.59 37.59,24.21 37.59,22.86 37.48,22.75 R5.2
  Bottom 0.203: R18.1 v36.55,24.59
SDO  (via drill 0.3)
  Top 0.203: IC2.43 35.92,24.87 v36.55,25.5 37.11,25.5 38.38,24.23 R4.2
  Bottom 0.203: R19.1 v36.55,25.5
SSEL  (via drill 0.3)
  Top 0.203: R1.1 v39.34,21.03 | IC1.2 15.28,4.53 v12.39,7.42
  Route15 0.203: v39.34,21.03 39.32,21.03 38.91,20.62 38.91,17.48 31.09,9.65 15.24,9.65 13.11,7.52 12.5,7.52 v12.39,7.42
SWCLK  (via drill 0.3)
  Top 0.203: IC1.29 7.84,7.53 v7.82,7.52 | JP2.4 28.45,2.92 27.96,3.4 26.11,3.4 24.89,2.18 v24.89,1.52
  Route15 0.203: v7.82,7.52 7.82,6.3 12.09,2.03 24.38,2.03 v24.89,1.52
SWDIO  (via drill 0.3)
  Top 0.203: IC1.39 11.91,5.01 v11.99,5.08 | JP2.3 v28.45,7.32
  Route15 0.203: v11.99,5.08 11.99,3.96 12.7,3.25 27.13,3.25 28.45,4.57 v28.45,7.32
V+  (via drill 0.3)
  Top 0.203: IC2.1 30.14,25.37 v30.18,25.4 32.11,27.33 34.19,27.33 34.78,26.74 D1.C
  Top 0.279: IC2.1 26.38,25.37 25.28,24.26 C1.1
  Bottom 0.203: Q1.3 31.74,27.88 30.28,26.42 30.28,25.5 v30.18,25.4 29.97,25.2 R10.2
V+S  (via drill 0.3)
  Top 0.203: D2.C 27.18,28.8 27.64,28.35 v28.75,28.35 29.36,28.96 RGQ1_1.1
  Bottom 0.203: Q1.2 29.46,29.13 V+R.2 29.43,29.02 v28.75,28.35
VREF  (via drill 0.3)
  Top 0.203: IC2.31 34.01,18.87 33.55,18.41 v33.4,18.41
  Bottom 0.203: CVREF.2 v33.4,18.41
VREG  (via drill 0.3)
  Top 0.203: v33.43,19.2 33.59,19.37 IC2.32 36.72,19.37 R2.2
  Bottom 0.203: v33.43,19.2 32.72,19.2 32.56,19.36 CVREG.2 32.21,19.65 32.21,23.37 32.42,23.58 R17.2 R18.2 R19.2 R20.2
WDTB
  Top 0.203: IC2.34 36.72,20.37 R2.1
XTALIN  (via drill 0.3)
  Top 0.203: IC1.6 16.18,6.53 v15.95,6.3
  Bottom 0.203: v15.95,6.3 17.38,6.3 Y1.2 17.74,5.28 C15.2
XTALOUT  (via drill 0.3)
  Top 0.203: IC1.7 16.03,7.03 v15.95,7.11
  Bottom 0.203: v15.95,7.11 16.26,7.11 16.97,7.82 16.97,8.74 17.27,9.04 19.2,9.04 19.67,8.57 Y1.1 20.62,7.81 C14.2

### Text on the board
Top: canSlaveV028s
Document: C8 (+) | C0 (-)